# Altium project QUTMS_Shutdownboard_V2_1_Base.PrjPcb (part 1 of 2)
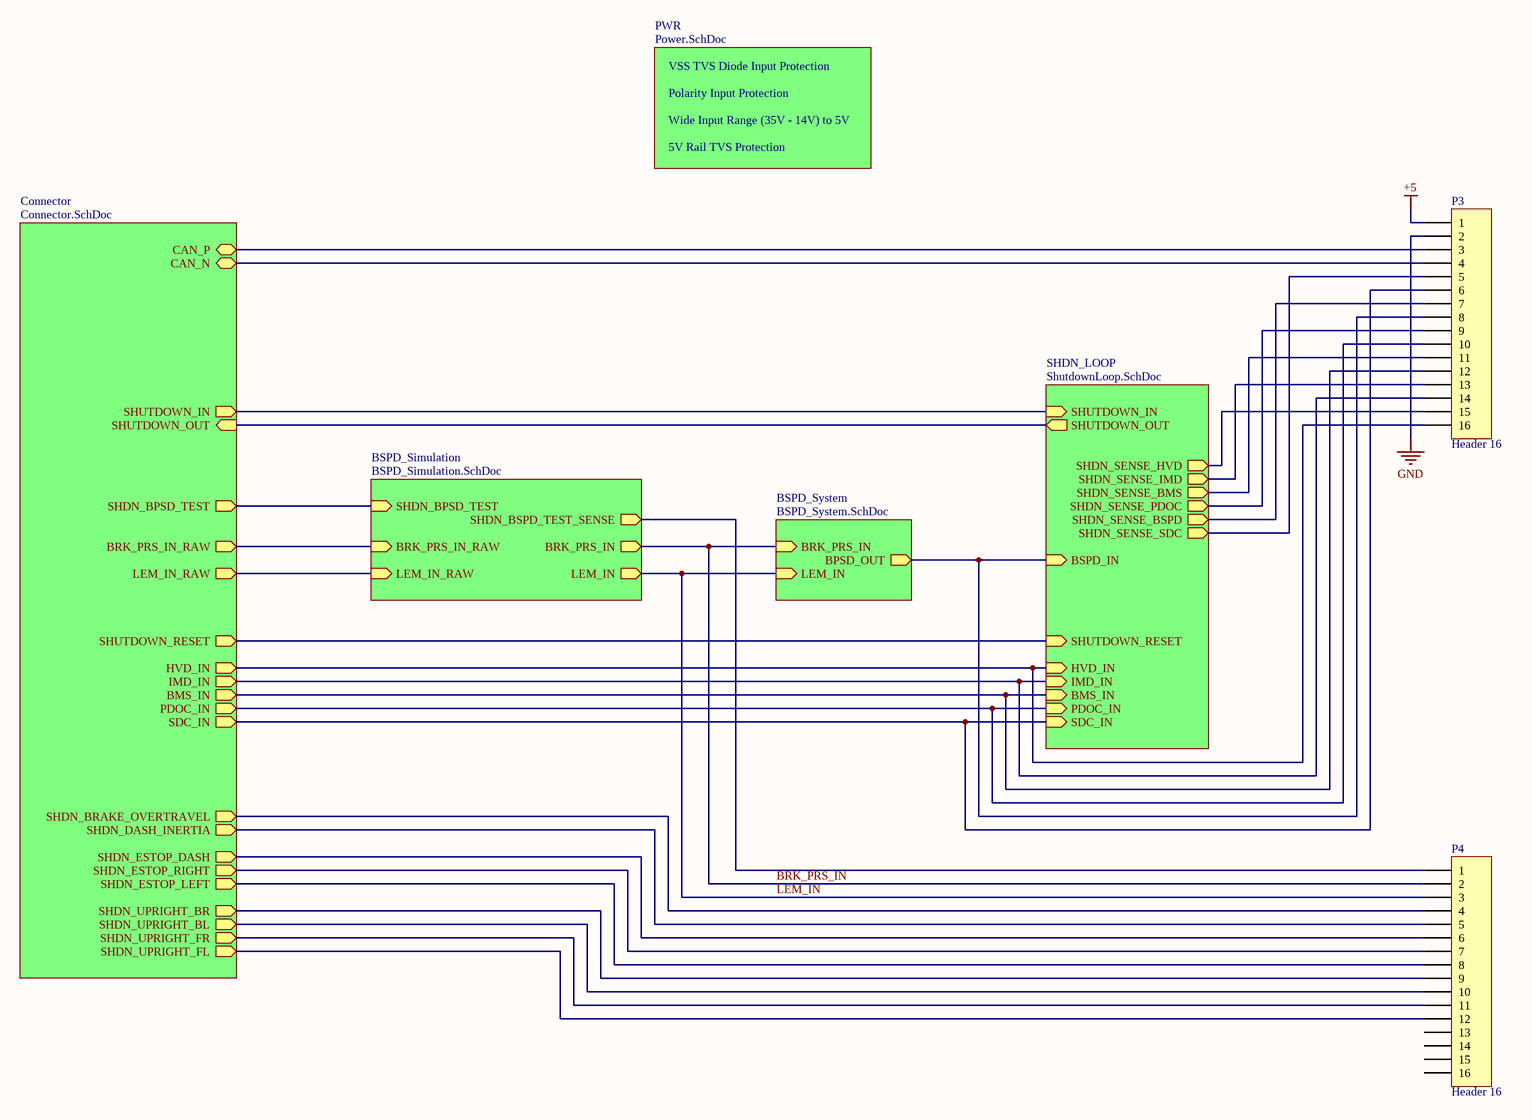
[diagram p0: Master.SchDoc]
7 sheets, 165 parts. Net scope: hierarchical (ports join the sheet entries above them; power ports are global).
Board file: DeutschPCB.PcbDoc
Sheets:
  Master.SchDoc
    Connector = Connector.SchDoc
    SHDN_LOOP = ShutdownLoop.SchDoc
      SHDN_SEG1 = ShutdownSegement.SchDoc
      SHDN_SEG2 = ShutdownSegement.SchDoc
      SHDN_SEG3 = ShutdownSegement.SchDoc
      SHDN_SEG4 = ShutdownSegement.SchDoc
      SHDN_SEG5 = ShutdownSegement.SchDoc
      SHDN_SEG6 = ShutdownSegement.SchDoc
    PWR = Power.SchDoc
    BSPD_System = BSPD_System.SchDoc
    BSPD_Simulation = BSPD_Simulation.SchDoc

## Sheet Master.SchDoc: QUTMS Shutdown Board V2.1 - Master Bottom
size A3; DocumentNumber: 1; Revision: 4; SheetNumber: 1; SheetTotal: 7

### Parts
P3  Header 16  [HDR1X16]
P4  Header 16  [HDR1X16]

### Sub-sheets
BSPD_Simulation = BSPD_Simulation.SchDoc: LEM_IN_RAW (in), SHDN_BSPD_TEST_SENSE (out), BRK_PRS_IN (out), LEM_IN (out), SHDN_BPSD_TEST (in), BRK_PRS_IN_RAW (in)
BSPD_System = BSPD_System.SchDoc: BRK_PRS_IN (in), BPSD_OUT (out), LEM_IN (in)
Connector = Connector.SchDoc: SHDN_BRAKE_OVERTRAVEL (out), SHDN_BPSD_TEST (out), CAN_N (bidir), CAN_P (bidir), SHUTDOWN_IN (out), HVD_IN (out), SHUTDOWN_OUT (in), BRK_PRS_IN_RAW (out), LEM_IN_RAW (out), IMD_IN (out), BMS_IN (out), SHDN_ESTOP_DASH (out), SHDN_DASH_INERTIA (out), PDOC_IN (out), SHUTDOWN_RESET (out), SHDN_ESTOP_RIGHT (out), SHDN_ESTOP_LEFT (out), SHDN_UPRIGHT_BR (out), SHDN_UPRIGHT_BL (out), SHDN_UPRIGHT_FR (out), SHDN_UPRIGHT_FL (out), SDC_IN (out)
PWR = Power.SchDoc: no entries
SHDN_LOOP = ShutdownLoop.SchDoc: SHDN_SENSE_BSPD (out), SHDN_SENSE_PDOC (out), SHDN_SENSE_BMS (out), SHDN_SENSE_IMD (out), HVD_IN (in), SHUTDOWN_RESET (in), IMD_IN (in), BMS_IN (in), PDOC_IN (in), SHUTDOWN_OUT (out), SHUTDOWN_IN (in), BSPD_IN (in), SHDN_SENSE_HVD (out), SDC_IN (in), SHDN_SENSE_SDC (out)

### Nets
+5: P3.1
GND: P3.2
BMS_IN: P3.12 ; sheet Connector/BMS_IN, sheet SHDN_LOOP/BMS_IN
BRK_PRS_IN: P4.2 ; sheet BSPD_System/BRK_PRS_IN, sheet BSPD_Simulation/BRK_PRS_IN
BRK_PRS_IN_RAW: sheet Connector/BRK_PRS_IN_RAW, sheet BSPD_Simulation/BRK_PRS_IN_RAW
CAN_N: P3.4 ; sheet Connector/CAN_N
CAN_P: P3.3 ; sheet Connector/CAN_P
HVD_IN: P3.16 ; sheet Connector/HVD_IN, sheet SHDN_LOOP/HVD_IN
IMD_IN: P3.14 ; sheet Connector/IMD_IN, sheet SHDN_LOOP/IMD_IN
LEM_IN: P4.3 ; sheet BSPD_System/LEM_IN, sheet BSPD_Simulation/LEM_IN
LEM_IN_RAW: sheet Connector/LEM_IN_RAW, sheet BSPD_Simulation/LEM_IN_RAW
PDOC_IN: P3.10 ; sheet Connector/PDOC_IN, sheet SHDN_LOOP/PDOC_IN
SDC_IN: P3.6 ; sheet Connector/SDC_IN, sheet SHDN_LOOP/SDC_IN
SHDN_BPSD_TEST: sheet Connector/SHDN_BPSD_TEST, sheet BSPD_Simulation/SHDN_BPSD_TEST
SHDN_BRAKE_OVERTRAVEL: P4.4 ; sheet Connector/SHDN_BRAKE_OVERTRAVEL
SHDN_BSPD_TEST_COMMAND: P4.1 ; sheet BSPD_Simulation/SHDN_BSPD_TEST_SENSE
SHDN_DASH_INERTIA: P4.5 ; sheet Connector/SHDN_DASH_INERTIA
SHDN_ESTOP_DASH: P4.6 ; sheet Connector/SHDN_ESTOP_DASH
SHDN_ESTOP_LEFT: P4.8 ; sheet Connector/SHDN_ESTOP_LEFT
SHDN_ESTOP_RIGHT: P4.7 ; sheet Connector/SHDN_ESTOP_RIGHT
SHDN_IN1: sheet Connector/SHUTDOWN_IN, sheet SHDN_LOOP/SHUTDOWN_IN
SHDN_OUT6: sheet Connector/SHUTDOWN_OUT, sheet SHDN_LOOP/SHUTDOWN_OUT
SHDN_UPRIGHT_BL: P4.10 ; sheet Connector/SHDN_UPRIGHT_BL
SHDN_UPRIGHT_BR: P4.9 ; sheet Connector/SHDN_UPRIGHT_BR
SHDN_UPRIGHT_FL: P4.12 ; sheet Connector/SHDN_UPRIGHT_FL
SHDN_UPRIGHT_FR: P4.11 ; sheet Connector/SHDN_UPRIGHT_FR
SHUTDOWN_RESET: sheet Connector/SHUTDOWN_RESET, sheet SHDN_LOOP/SHUTDOWN_RESET
STATE_SENSE1: P3.15 ; sheet SHDN_LOOP/SHDN_SENSE_HVD
STATE_SENSE2: P3.13 ; sheet SHDN_LOOP/SHDN_SENSE_IMD
STATE_SENSE3: P3.11 ; sheet SHDN_LOOP/SHDN_SENSE_BMS
STATE_SENSE4: P3.9 ; sheet SHDN_LOOP/SHDN_SENSE_PDOC
STATE_SENSE5: P3.7 ; sheet SHDN_LOOP/SHDN_SENSE_BSPD
STATE_SENSE6: P3.5 ; sheet SHDN_LOOP/SHDN_SENSE_SDC
STATE_TRIGGER5: P3.8 ; sheet SHDN_LOOP/BSPD_IN, sheet BSPD_System/BPSD_OUT

Not connected (* = marked no-connect by the designer): P4 13 14 15 16

### Notes on the sheet
- VSS TVS Diode Input Protection
- Polarity Input Protection
- Wide Input Range (35V - 14V) to 5V
- 5V Rail TVS Protection
- Title
- Size:
- A4
- Number:
- Revision:
- QUT Motorsport, O-120
- O Block, QUT Gardens Point
- Date:
- Time:
- Sheet
- of
- Brisbane, QLD, Australia

### Library data of the parts
P3 P4 = Header 16: Header, 16-Pin; LatestRevisionDate: 17-Jul-2002; LatestRevisionNote: Re-released for DXP Platform.; Publisher: Altium Limited

## Sheet Connector.SchDoc: QUTMS Shutdown V2.1 - Connector
size A4; Organization: QUT Motorsport; Address1: O-120; Address2: O Block; Address3: QUT Gardens Point; Address4: Brisbane, 4000; DocumentNumber: 7; Revision: 3; SheetNumber: 7; SheetTotal: 7
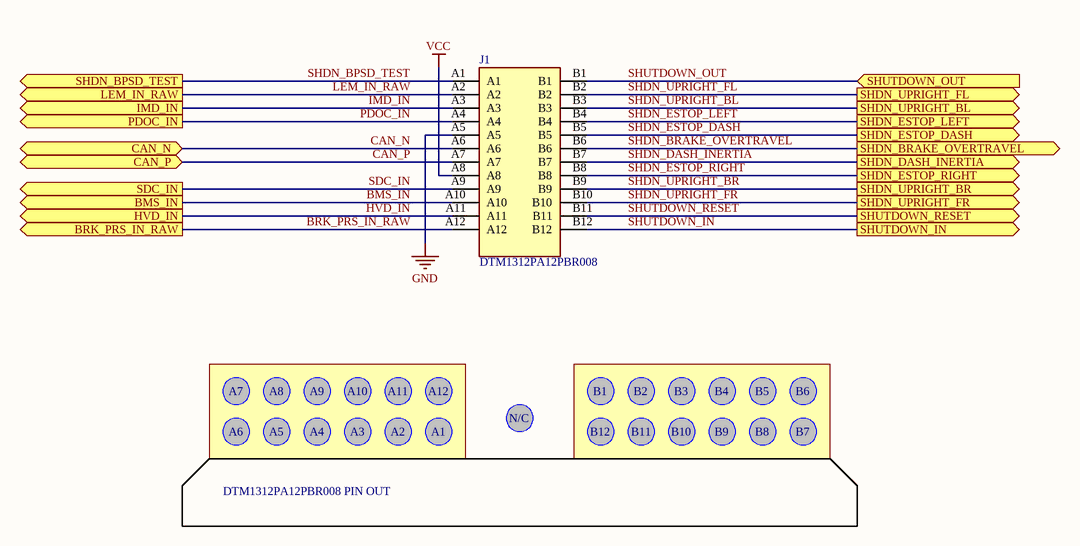
[diagram p1: Connector.SchDoc]

### Parts
J1  DTM1312PA12PBR008  [TE_DTM1312PA12PBR008]

### Ports
BMS_IN (out), BRK_PRS_IN_RAW (out), CAN_N (bidir), CAN_P (bidir), HVD_IN (out), IMD_IN (out), LEM_IN_RAW (out), PDOC_IN (out), SDC_IN (out), SHDN_BPSD_TEST (out), SHDN_BRAKE_OVERTRAVEL (out), SHDN_DASH_INERTIA (out), SHDN_ESTOP_DASH (out), SHDN_ESTOP_LEFT (out), SHDN_ESTOP_RIGHT (out), SHDN_UPRIGHT_BL (out), SHDN_UPRIGHT_BR (out), SHDN_UPRIGHT_FL (out), SHDN_UPRIGHT_FR (out), SHUTDOWN_IN (out), SHUTDOWN_OUT (in), SHUTDOWN_RESET (out)

### Nets
GND: J1.A5
VCC: J1.A8
BMS_IN: J1.A10 ; port BMS_IN
BRK_PRS_IN_RAW: J1.A12 ; port BRK_PRS_IN_RAW
CAN_N: J1.A6 ; port CAN_N
CAN_P: J1.A7 ; port CAN_P
HVD_IN: J1.A11 ; port HVD_IN
IMD_IN: J1.A3 ; port IMD_IN
LEM_IN_RAW: J1.A2 ; port LEM_IN_RAW
PDOC_IN: J1.A4 ; port PDOC_IN
SDC_IN: J1.A9 ; port SDC_IN
SHDN_BPSD_TEST: J1.A1 ; port SHDN_BPSD_TEST
SHDN_BRAKE_OVERTRAVEL: J1.B6 ; port SHDN_BRAKE_OVERTRAVEL
SHDN_DASH_INERTIA: J1.B7 ; port SHDN_DASH_INERTIA
SHDN_ESTOP_DASH: J1.B5 ; port SHDN_ESTOP_DASH
SHDN_ESTOP_LEFT: J1.B4 ; port SHDN_ESTOP_LEFT
SHDN_ESTOP_RIGHT: J1.B8 ; port SHDN_ESTOP_RIGHT
SHDN_UPRIGHT_BL: J1.B3 ; port SHDN_UPRIGHT_BL
SHDN_UPRIGHT_BR: J1.B9 ; port SHDN_UPRIGHT_BR
SHDN_UPRIGHT_FL: J1.B2 ; port SHDN_UPRIGHT_FL
SHDN_UPRIGHT_FR: J1.B10 ; port SHDN_UPRIGHT_FR
SHUTDOWN_IN: J1.B12 ; port SHUTDOWN_IN  [project net SHDN_IN1]
SHUTDOWN_OUT: J1.B1 ; port SHUTDOWN_OUT  [project net SHDN_OUT6]
SHUTDOWN_RESET: J1.B11 ; port SHUTDOWN_RESET

### Notes on the sheet
- A7
- A8
- A9
- A10
- A11
- A12
- N/C
- B1
- B2
- B3
- B4
- B5
- B6
- A6
- A5
- A4
- A3
- A2
- A1
- B12
- B11
- B10
- B9
- B8
- B7
- DTM1312PA12PBR008 PIN OUT
- Title
- Size:
- Number:
- Revision:
- QUT Motorsport, O-120
- O Block, QUT Gardens Point
- Date:
- Time:
- Sheet
- of
- Brisbane, QLD, Australia

### Library data of the parts
J1 = DTM1312PA12PBR008: 24 way sealed A and B key PCB header with .165 inch/4.2 millimeter centerline pitch.; MP: DTM13-12PA-12PB-R008; MF: TE Connectivity; Digi-Key_Part_Number: 1734-1131-ND; Digi-Key_Purchase_URL: https://www.digikey.com/product-detail/en/te-connectivity-deutsch-connectors/DTM13-12PA-12PB-R008/1734-1131-ND/6566695?utm_source=snapeda&utm_medium=aggregator&utm_campaign=symbol; Package: None; Value: *; TE_purchase_URL: https://www.te.com/usa-en/product-DTM1312PA12PBR008.html?te_bu=Cor&te_type=disp&te_campaign=seda_glo_cor-seda-global-disp-prtnr-fy19-seda-model-bom-cta_sma-317_1&elqCampaignId=32493; SnapEDA_Link: https://www.snapeda.com/parts/DTM13-12PA-12PB-R008/TE%20Connectivity%20Deutsch%20Connectors/view-part/490507/?ref=snap

## Sheet ShutdownLoop.SchDoc: QUTMS Shutdown V2.1 - ShutdownLoop
size A4; Organization: QUT Motorsport; Address1: O-120; Address2: O Block; Address3: QUT Gardnes Point; Address4: Brisbane, 4000; DocumentNumber: 2; Revision: 9; SheetNumber: 2; SheetTotal: 7
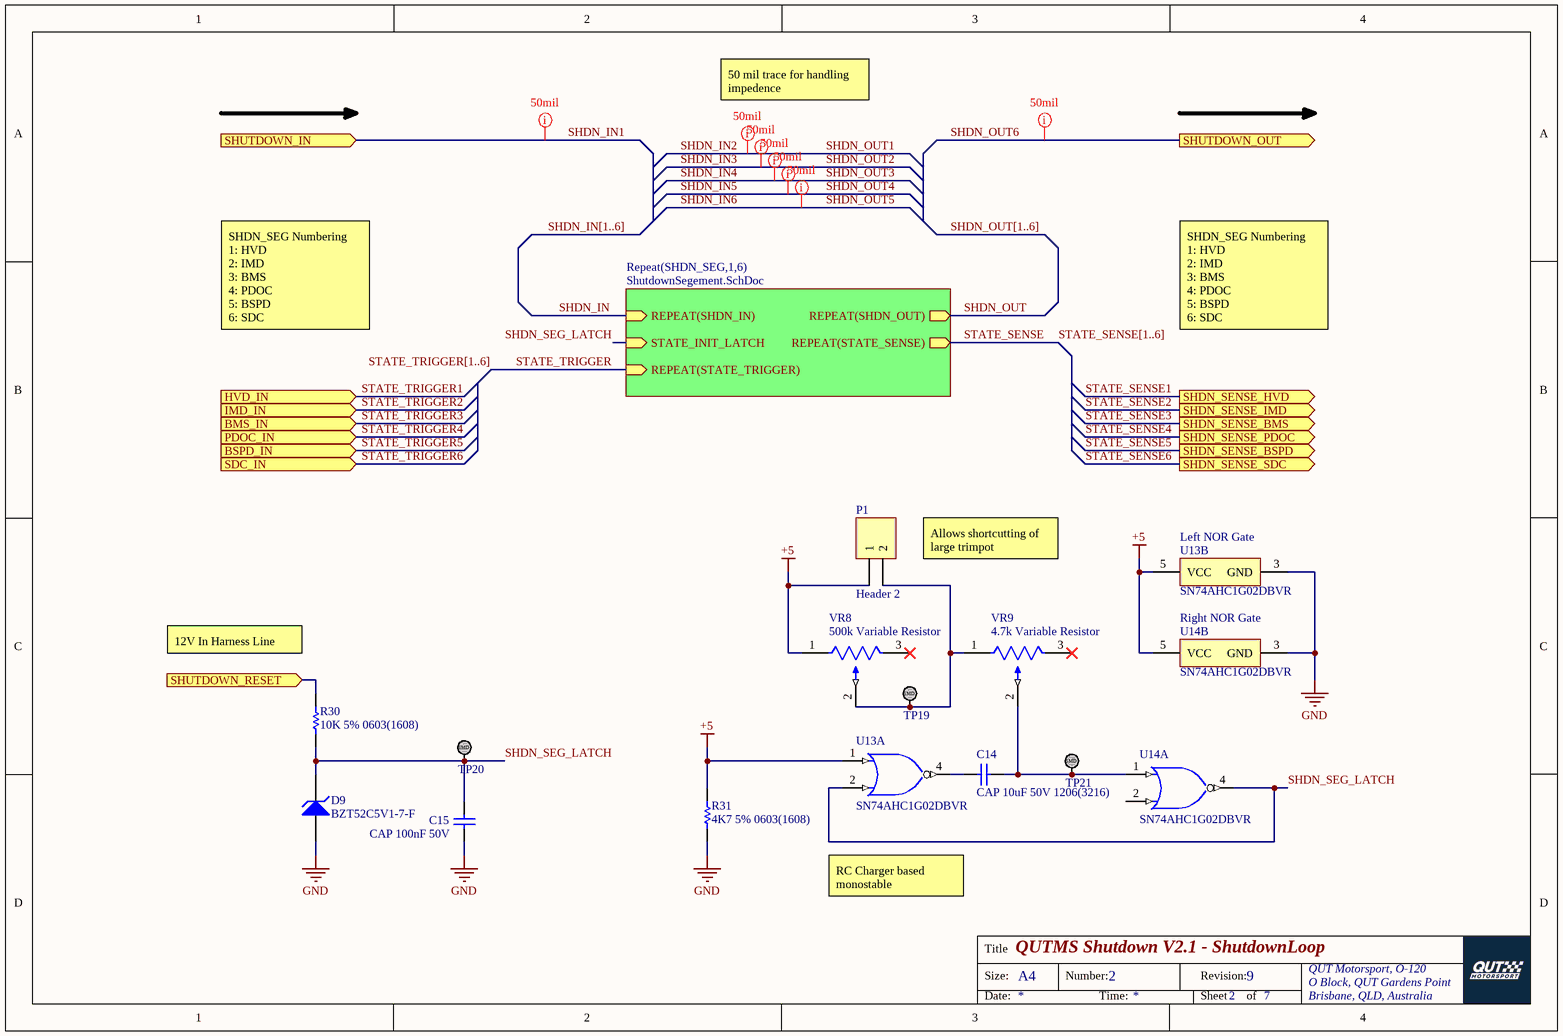
[diagram p2: ShutdownLoop.SchDoc]

### Parts
C14  CAP 10uF 50V 1206(3216)  [CAPC1206(3216)190_M]
C15  CAP 100nF 50V  [CAPC0603(1608)100_L]
D9  BZT52C5V1-7-F  [DIOD-SOD123_V]
P1  Header 2  [HDR1X2]
R30  10K 5% 0603(1608)  [RESC0603(1608)_N]
R31  4K7 5% 0603(1608)  [RESC0603(1608)_N]
TP19  TestPoint_SMD  [TestPointSMD]  (value not drawn)
TP20  TestPoint_SMD  [TestPointSMD]  (value not drawn)
TP21  TestPoint_SMD  [TestPointSMD]  (value not drawn)
U13  SN74AHC1G02DBVR  [DBV0005A_L]  (parts A,B of 2)
U14  SN74AHC1G02DBVR  [DBV0005A_L]  (parts A,B of 2)
VR8  500k Variable Resistor  [VG039NCHXTB472]
VR9  4.7k Variable Resistor  [VG039NCHXTB472]

### Sub-sheets
Repeat(SHDN_SEG,1,6) = ShutdownSegement.SchDoc: REPEAT(SHDN_OUT) (out), REPEAT(SHDN_IN) (in), STATE_INIT_LATCH (in), REPEAT(STATE_TRIGGER) (in), REPEAT(STATE_SENSE) (out)

### Ports
BMS_IN (in), BSPD_IN (in), HVD_IN (in), IMD_IN (in), PDOC_IN (in), SDC_IN (in), SHDN_SENSE_BMS (out), SHDN_SENSE_BSPD (out), SHDN_SENSE_HVD (out), SHDN_SENSE_IMD (out), SHDN_SENSE_PDOC (out), SHDN_SENSE_SDC (out), SHUTDOWN_IN (in), SHUTDOWN_OUT (out), SHUTDOWN_RESET (in)

### Nets
+5: P1.1 R31.2 U13.1(A) U13.5(VCC) U14.5(VCC) VR8.1
GND: C15.2 D9.1(A) R31.1 U13.3(GND) U14.3(GND)
SHDN_IN: sheet Repeat(SHDN_SEG,1,6)/REPEAT(SHDN_IN)
SHDN_OUT: sheet Repeat(SHDN_SEG,1,6)/REPEAT(SHDN_OUT)
SHDN_SEG_LATCH: C15.1 D9.2(K) R30.2 TP20.1 U13.2(B) U14.4(Y) ; sheet Repeat(SHDN_SEG,1,6)/STATE_INIT_LATCH
SHUTDOWN_RESET: R30.1 ; port SHUTDOWN_RESET
STATE_SENSE: sheet Repeat(SHDN_SEG,1,6)/REPEAT(STATE_SENSE)
STATE_TRIGGER: sheet Repeat(SHDN_SEG,1,6)/REPEAT(STATE_TRIGGER)
NetC14_1: C14.1 TP21.1 U14.1(A) VR9.2
NetC14_2: C14.2 U13.4(Y)
NetP1_2: P1.2 TP19.1 VR8.2 VR9.1

Not connected (* = marked no-connect by the designer): U14 2(B); VR8 3(49)*; VR9 3(49)*

### Buses and harness runs
bus SHDN_IN[1..6]
bus SHDN_OUT[1..6]
bus STATE_SENSE[1..6]
bus STATE_TRIGGER[1..6]

### Layout directives
rule Width Constraint [Pref Width = 50mil    Min Width = 50mil    Max Width = 50mil]: SHDN_IN1, SHDN_IN2, SHDN_IN3, SHDN_IN4, SHDN_IN5, SHDN_IN6, SHDN_OUT6

### Notes on the sheet
- 50 mil trace for handling impedence
- SHDN_SEG Numbering
  1: HVD
  2: IMD
  3: BMS
  4: PDOC
  5: BSPD
  6: SDC
- (near P1) Allows shortcutting of large trimpot
- (near U13) Left NOR Gate
- 12V In Harness Line
- Right NOR Gate
- RC Charger based monostable
- Title
- Size:
- A4
- Number:
- Revision:
- QUT Motorsport, O-120
- O Block, QUT Gardens Point
- Date:
- Time:
- Sheet
- of
- Brisbane, QLD, Australia
- (in symbol TestPoint_SMD) SMD

### Library data of the parts
C14 = CMP-1037-04982-1: CAP 10uF 50V ±10% 1206 (3216 Metric) Thickness 1.9mm SMD; Case-EIA: 1206; Tolerance: Â±10%; Case-Metric: 3216; Technology: SMT; Max Thickness: 1.9 mm; Value: 10uF; Rated Voltage: 50 V
C15 = CMP-1035-02591-1: CAP 100nF 50V ±5% 0603 (1608 Metric) Thickness 1mm SMD; Tolerance: Â±5%; Case-Metric: 1608; Case-EIA: 0603; Rated Voltage: 50 V; Max Thickness: 1 mm; Technology: SMT; Value: 100nF
D9 = CMP-2000-05976-1: Surface Mount Zener Diode, 5.1 V, -65 to 150 degC, 2-Pin SMD (SOD-123), RoHS, Tape and Reel; Manufacturer: DiodesIncorporated; Unit Weight: 0.000353oz; Zz - Zener Impedance: 60Ohms; Vz - Zener Voltage: 5.1V; Pd - Power Dissipation: 500mW; Zener Current: 5mA; Ir - Reverse Current: 2uA; Voltage Temperature Coefficient: -0.75mV/C; Configuration: Single; Voltage Tolerance: 6%; Height: 1.35mm; Width: 1.7mm; Minimum Operating Temperature: -65C; Series: BZT52C5; Package Description: 2-Pin Surface Mount Device, Body 2.7 x 1.55 mm; Length: 2.85mm; Mounting Technology: SurfaceMount; Brand: DiodesIncorporated; Factory Pack Quantity: 3000; Product Category: ZenerDiodes; RoHS: True; Manufacturer URL: http://www.diodes.com/; Termination Style: SMD/SMT; Package / Case: SOD-123; Packaging: Reel; Package Reference: SOD123; Datasheet Version: Rev. 37-2, 09/2012; Maximum Operating Temperature: +150C; Datasheet URL: http://www.diodes.com/_files/datasheets/ds18004.pdf; Mounting Style: SMD/SMT
P1 = Header 2: Header, 2-Pin; LatestRevisionDate: 17-Jul-2002; LatestRevisionNote: Re-released for DXP Platform.; Publisher: Altium Limited
R30 = CMP-1012-00098-1: 10K 0.1W 5% 0603 (1608 Metric)  SMD; Case-EIA: 0603; Value: 10000.00 Ohm; Case-Metric: 1608; Technology: SMT; Tolerance: 5 %; Power: 0.1 W
R31 = CMP-1012-00090-1: 4K7 0.1W 5% 0603 (1608 Metric)  SMD; Case-Metric: 1608; Value: 4700.00 Ohm; Case-EIA: 0603; Tolerance: 5 %; Technology: SMT; Power: 0.1 W
U13 U14 = CMP-0859-00024-3: Single 2-Input Positive-NOR Gate, DBV0005A, LARGE T&R; Manufacturer: Texas Instruments; Output Drive (IOL/IOH)(Max)(mA): 50/-50; Sub-Family: NAND Gate; Gate Type: NOR; Output Type: CMOS; 3-State Output: No; Voltage(Nom)(V): 3.3,5; tpd @ Nom Voltage(Max)(ns): 11.4,7.5; Bits(#): 1; VCC(Max)(V): 5.5; ICC @ Nom Voltage(Max)(mA): 0.01; VCC(Min)(V): 2; Technology Family: AHC; Rating: Catalog; Logic: True; F @ Nom Voltage(Max)(Mhz): 75; DatasheetVersion: SCLS342M; Input Type: CMOS; Operating Temperature Range(C): -40 to 125,-40 to 85; Generic Part Number: SN74AHC1G02; PackageReference: DBV0005A; Schmitt Trigger: No
VR8 = 500k Variable Resistor: 500K ±25% ±250 ppm/°C SMD Variable Resistors RoHS | VG039NCHXTB504; ComponentLink1Description: LCSC; ComponentLink1URL: https://lcsc.com/product-detail/Variable-Resistors_HDK-Hokuriku-Elec-Industry-VG039NCHXTB504_C128558.html
VR9 = 4.7k Variable Resistor: 4k7 ±25% ±250 ppm/°C SMD Variable Resistors RoHS | VG039NCHXTB472; ComponentLink1Description: LCSC; ComponentLink1URL: https://lcsc.com/product-detail/Variable-Resistors_HDK-Hokuriku-Elec-Industry-VG039NCHXTB472_C128555.html

## Sheet ShutdownSegement.SchDoc: QUTMS Shutdown V2.1 - Shutdown Segment
size A4; DocumentNumber: 3; Revision: 6; SheetNumber: 3; SheetTotal: 7
Used 6 times, as channels SHDN_LOOP/SHDN_SEG1, SHDN_LOOP/SHDN_SEG2, SHDN_LOOP/SHDN_SEG3, SHDN_LOOP/SHDN_SEG4, SHDN_LOOP/SHDN_SEG5, SHDN_LOOP/SHDN_SEG6. Parts and nets are listed once, with the designators drawn on the sheet.
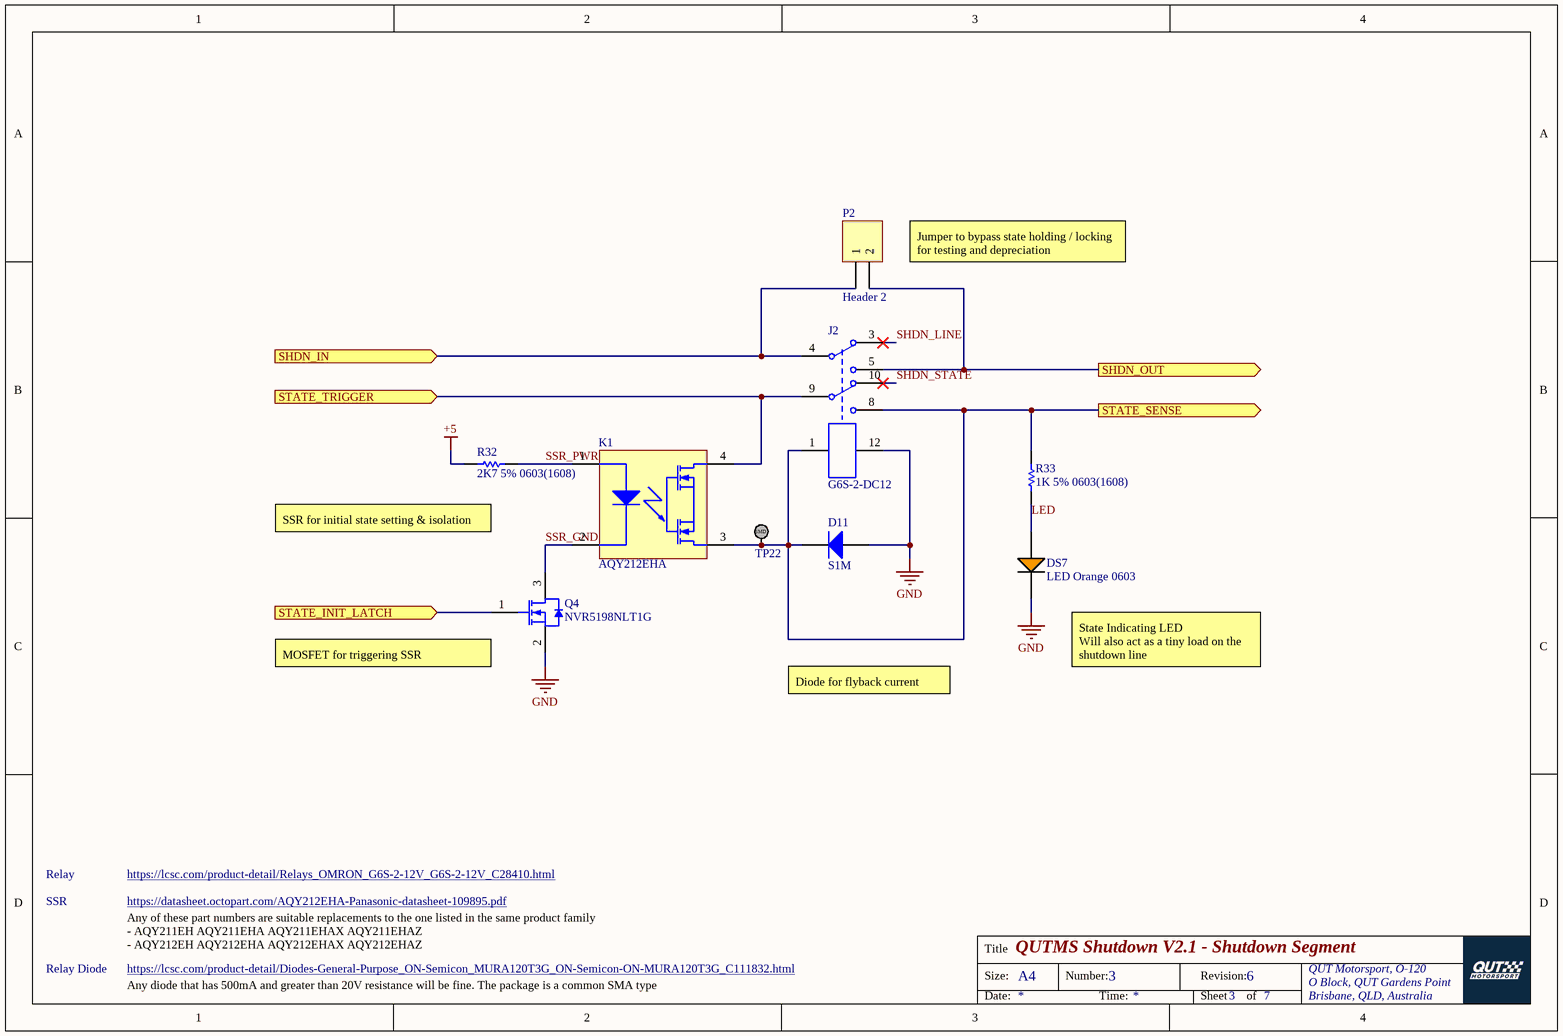
[diagram p3: ShutdownSegement.SchDoc]

### Parts
D11  S1M  [FAIR-DO-214AC-2_V]
DS7  LED Orange 0603  [LED ORANGE 0603]
J2  G6S-2-DC12  [G6S-2]
K1  AQY212EHA  [PNSC-DIP4(SMT)_V]
P2  Header 2  [HDR1X2]
Q4  NVR5198NLT1G  [ONSC-SOT-23-3-318-08_V]
R32  2K7 5% 0603(1608)  [RESC0603(1608)_M]
R33  1K 5% 0603(1608)  [RESC0603(1608)_L]
TP22  TestPoint_SMD  [TestPointSMD]  (value not drawn)

### Ports
SHDN_IN (in), SHDN_OUT (out), STATE_INIT_LATCH (in), STATE_SENSE (out), STATE_TRIGGER (in)

### Nets
+5: R32.1
GND: D11.1(A) DS7.2(C) J2.12 Q4.2(S)
LED: DS7.1(A) R33.1
SHDN_IN: J2.4 P2.1 ; port SHDN_IN
SHDN_LINE: J2.3
SHDN_OUT: J2.5 P2.2 ; port SHDN_OUT
SHDN_STATE: J2.10
SSR_GND: K1.2 Q4.3(D)
SSR_PWR: K1.1 R32.2
STATE_INIT_LATCH: Q4.1(G) ; port STATE_INIT_LATCH
STATE_SENSE: D11.2(K) J2.1 J2.8 K1.3 R33.2 TP22.1 ; port STATE_SENSE
STATE_TRIGGER: J2.9 K1.4 ; port STATE_TRIGGER

### Channels
SHDN_LOOP/SHDN_SEG1: designators end in _SHDN_SEG1; ports SHDN_IN=SHDN_IN1 SHDN_OUT=SHDN_IN2 STATE_INIT_LATCH=SHDN_SEG_LATCH STATE_SENSE=STATE_SENSE1 STATE_TRIGGER=HVD_IN
SHDN_LOOP/SHDN_SEG2: designators end in _SHDN_SEG2; ports SHDN_IN=SHDN_IN2 SHDN_OUT=SHDN_IN3 STATE_INIT_LATCH=SHDN_SEG_LATCH STATE_SENSE=STATE_SENSE2 STATE_TRIGGER=IMD_IN
SHDN_LOOP/SHDN_SEG3: designators end in _SHDN_SEG3; ports SHDN_IN=SHDN_IN3 SHDN_OUT=SHDN_IN4 STATE_INIT_LATCH=SHDN_SEG_LATCH STATE_SENSE=STATE_SENSE3 STATE_TRIGGER=BMS_IN
SHDN_LOOP/SHDN_SEG4: designators end in _SHDN_SEG4; ports SHDN_IN=SHDN_IN4 SHDN_OUT=SHDN_IN5 STATE_INIT_LATCH=SHDN_SEG_LATCH STATE_SENSE=STATE_SENSE4 STATE_TRIGGER=PDOC_IN
SHDN_LOOP/SHDN_SEG5: designators end in _SHDN_SEG5; ports SHDN_IN=SHDN_IN5 SHDN_OUT=SHDN_IN6 STATE_INIT_LATCH=SHDN_SEG_LATCH STATE_SENSE=STATE_SENSE5 STATE_TRIGGER=STATE_TRIGGER5
SHDN_LOOP/SHDN_SEG6: designators end in _SHDN_SEG6; ports SHDN_IN=SHDN_IN6 SHDN_OUT=SHDN_OUT6 STATE_INIT_LATCH=SHDN_SEG_LATCH STATE_SENSE=STATE_SENSE6 STATE_TRIGGER=SDC_IN

### Notes on the sheet
- (near P2) Jumper to bypass state holding / locking for testing and depreciation
- (near R32) SSR for initial state setting & isolation
- (near Q4) MOSFET for triggering SSR
- Diode for flyback current
- State Indicating LED
  Will also act as a tiny load on the shutdown line
- SSR
- Relay
- https://datasheet.octopart.com/AQY212EHA-Panasonic-datasheet-109895.pdf
- https://lcsc.com/product-detail/Relays_OMRON_G6S-2-12V_G6S-2-12V_C28410.html
- Relay Diode
- Any of these part numbers are suitable replacements to the one listed in the same product family
  - AQY211EH AQY211EHA AQY211EHAX AQY211EHAZ
  - AQY212EH AQY212EHA AQY212EHAX AQY212EHAZ
- https://lcsc.com/product-detail/Diodes-General-Purpose_ON-Semicon_MURA120T3G_ON-Semicon-ON-MURA120T3G_C111832.html
- Any diode that has 500mA and greater than 20V resistance will be fine. The package is a common SMA type
- Title
- Size:
- A4
- Number:
- Revision:
- QUT Motorsport, O-120
- O Block, QUT Gardens Point
- Date:
- Time:
- Sheet
- of
- Brisbane, QLD, Australia
- (in symbol TestPoint_SMD) SMD

### Library data of the parts
D11 = CMP-2000-04942-2: General Purpose Rectifier, 1 A, 1000 V, -55 to 150 degC, 2-Pin DO-214AC, RoHS, Tape and Reel; Manufacturer: Fairchild; Repetitive Reverse Voltage Vrrm Max: 1kV; Reel Quantity: 7500; Forward Voltage: 1V; No. of Pins: 2; External Depth: 2.79mm; Current Ifsm: 30A; Diode Configuration: Single; Reverse Recovery Time trr Max: 1.8µs; Diode Type: StandardRecovery; External Width: 5.28mm; SVHC: NoSVHC(19-Dec-2012); External Length / Height: 2.44mm; Diode Polarity: Cathode; Current If @ Vf: 1A; SMD Marking: 1M; Tape Width: 12mm; Datasheet URL: https://datasheet.ciiva.com/4452/s1m-191340-4452980.pdf; Alternate Case Style: DO-214AC; Package Reference: DO-214AC-2; Diode Case Style: DO-214AC; Package / Case: SMA; Junction Temperature Tj Max: 150degC; Operating Temperature Range: -55degCto+150degC; Operating Temperature Min: -55degC; Datasheet Version: Rev. 1.1.2, 10/2013; Manufacturer URL: https://www.fairchildsemi.com/; Termination Type: SMD; Forward Surge Current Ifsm Max: 30A; Operating Temperature Max: 150degC; Package Description: 2-Pin Surface Mount Device, Body 4.375 x 2.725 mm; Package URL: https://www.fairchildsemi.com/package-drawings/DO/DO214AC.pdf; Reverse Recovery Time trr Typ: 1.8µs; Forward Voltage VF Max: 1V; Forward Current If(AV): 1A
J2 = G6S-2-DC12: Telecom Non Latching 12VDC DPDT 2A Through Hole Relays RoHS; ComponentLink1Description: LCSC; ComponentLink1URL: https://lcsc.com/product-detail/Relays_OMRON_G6S-2-12V_G6S-2-12V_C28410.html
K1 = CMP-1346-00006-1: PhotoMOS GE 1 Form A, 60 V Load Voltage, 0.55 A Continuous Load Current, -40 to 85 degC, 4-Pin DIP(SMT), Tube, RoHS; Manufacturer: Panasonic; Continuous Load Current: 0.55 A; Load Voltage: 60 V; On Resistance (Typ): 0.85 Ohm; Pb-Free: True; ComponentLink2Description: Datasheet; PackageVersion: ASCTB67E, 04/2014; DatasheetVersion: 201404-T; Packing: Tube; ComponentLink1URL: http://www3.panasonic.biz/ac/ae/index.jsp; PackageReference: DIP4(SMT); Series: PhotoMOS GE 1 Form A; RoHS: True; ComponentLink1Description: Manufacturer URL; ComponentLink3Description: Package Specification; PartNumber: AQY212EHA; PackageDescription: 4-Pin Surface Mount Terminal Package, Body 4.78 x 6.4 mm, Pitch 2.54mm; ComponentLink2URL: http://www3.panasonic.biz/ac/e_download/control/relay/photomos/catalog/semi_eng_ge1a_aqy21_e.pdf; ComponentLink3URL: http://www3.panasonic.biz/ac/e_download/control/relay/photomos/catalog/semi_eng_dimensions.pdf?f_cd=401560; Mounting Technology: Surface Mount
P2 = Header 2: Header, 2-Pin; LatestRevisionDate: 17-Jul-2002; LatestRevisionNote: Re-released for DXP Platform.; Publisher: Altium Limited
Q4 = CMP-1058-00774-1: Power MOSFET, 60 V, 155 mOhm, Single N-Channel Logic Level, 3-Pin SOT-23, Pb-Free, Tape and Reel; Manufacturer: On Semiconductor; Ciss Typ (pF): 182; Coss Typ (pF): 25; ID Max (A): 2.2; Crss Typ (pF): 16; V(BR)DSS Min (V): 60; Qrr Typ (nC): 6; VGS Max (V): 20; VGS(th) Max (V): 2.5; Channel Polarity: N Channel; Package Type: SOT-23-3; ComponentLink1URL: http://www.onsemi.com/; ComponentLink2Description: Datasheet; ComponentLink1Description: Manufacturer URL; Mounting Technology: Surface Mount; Configuration: Single; Packing: Tape and Reel; RoHS: Pb-Free; ComponentLink3URL: http://www.onsemi.cn/pub_link/Collateral/318-08.PDF; PackageVersion: Rev. AP, 11/2009; PackageReference: SOT-23-3-318-08; DatasheetVersion: Rev. 1; PackageDescription: 3-Pin Small Outline Transistor, Body 2.92 x 1.3 mm, Pitch 0.95 mm; ComponentLink3Description: Package Specification; ComponentLink2URL: http://www.onsemi.com/pub_link/Collateral/NVR5198NL-D.PDF; PartNumber: NVR5198NLT1G
R32 = CMP-1012-00084-1: 2K7 0.1W 5% 0603 (1608 Metric)  SMD; Case-EIA: 0603; Value: 2700.00 Ohm; Case-Metric: 1608; Tolerance: 5 %; Power: 0.1 W; Technology: SMT
R33 = CMP-1012-00074-1: 1K 0.1W 5% 0603 (1608 Metric)  SMD; Case-EIA: 0603; Case-Metric: 1608; Value: 1000.00 Ohm; Technology: SMT; Tolerance: 5 %; Power: 0.1 W

## Sheet Power.SchDoc: QUTMS Shutdown V2.1 - Power Stage
size A4; Author: Jonn Dillon; Organization: QUT Motorsport; Address1: O-120; Address2: O Block; Address3: QUT Gardens Point; Address4: Brisbane, 4000; DocumentNumber: 6; Revision: 2; SheetNumber: 6; SheetTotal: 7
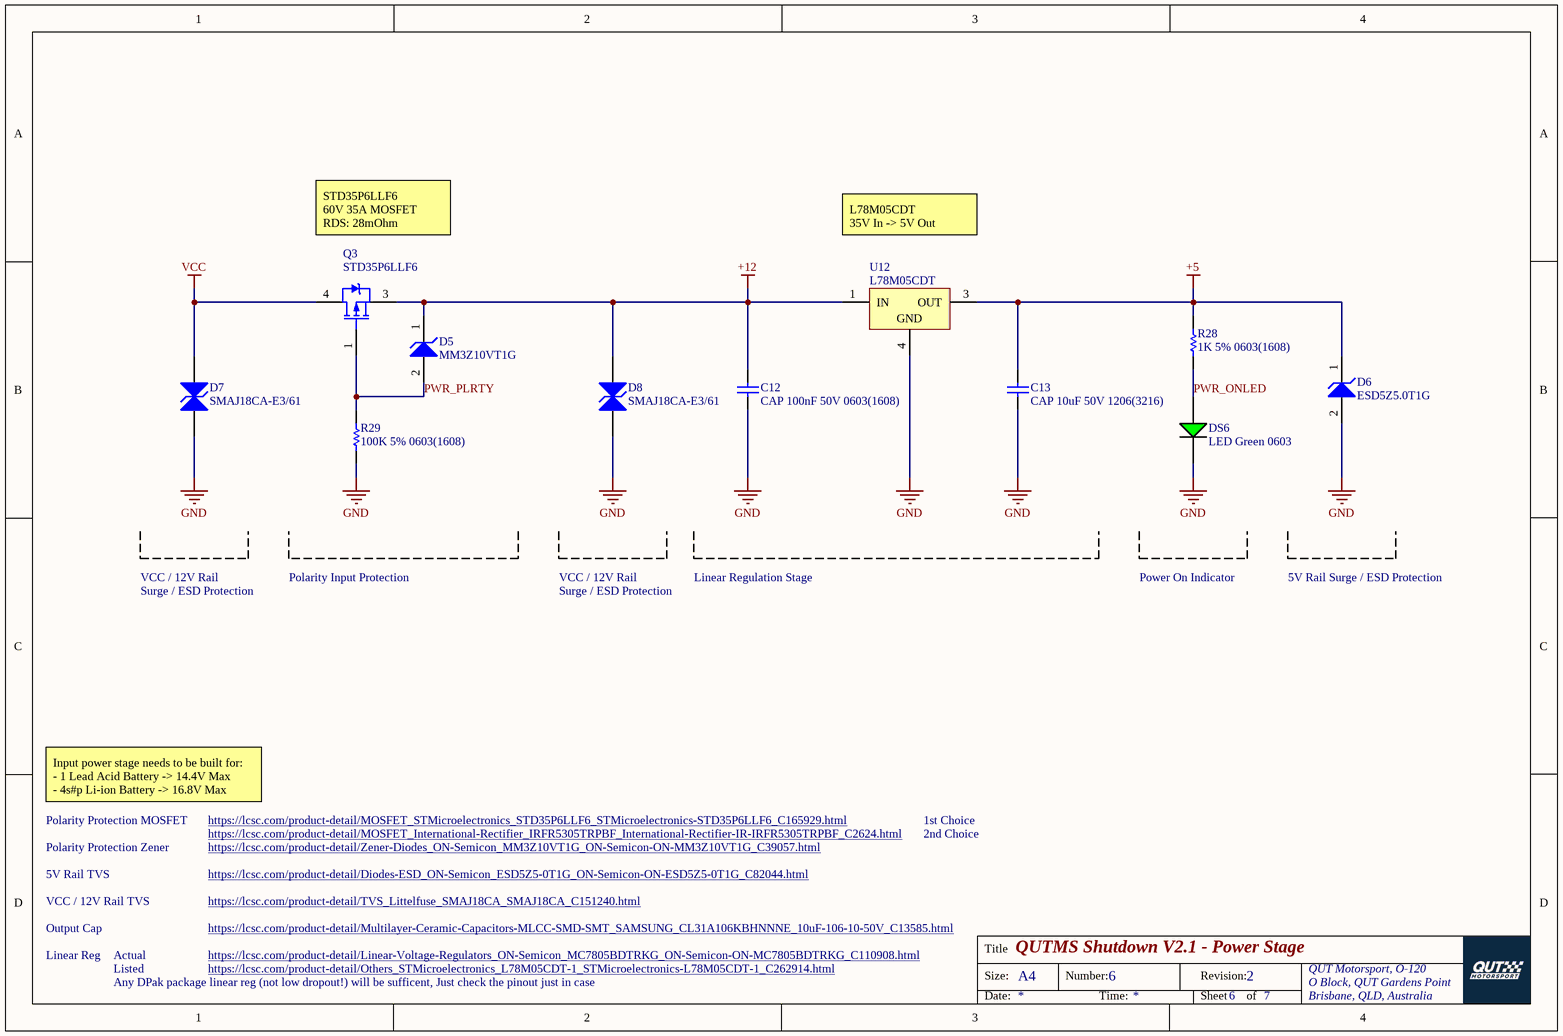
[diagram p4: Power.SchDoc]

### Parts
C12  CAP 100nF 50V 0603(1608)  [CAPC0603(1608)100_N]
C13  CAP 10uF 50V 1206(3216)  [CAPC1206(3216)190_N]
D5  MM3Z10VT1G  [ONSC-SOD-323-2-477-02_V]
D6  ESD5Z5.0T1G  [ONSC-SOD-523-2-502-01_V]
D7  SMAJ18CA-E3/61  [VISH-DO-214AC-2_N]
D8  SMAJ18CA-E3/61  [VISH-DO-214AC-2_N]
DS6  LED Green 0603  [LED GREEN 0603]
Q3  STD35P6LLF6  [ONSC-DPAK-3-369C-01_V]
R28  1K 5% 0603(1608)  [RESC0603(1608)_N]
R29  100K 5% 0603(1608)  [RESC0603(1608)_N]
U12  L78M05CDT  [STM-TO252-3_A_V]

### Nets
+5: C13.2 D6.1(K) R28.2 U12.3(OUT)
+12: C12.2 D5.1(K) D8.2(A2) Q3.3(S) U12.1(IN)
GND: C12.1 C13.1 D6.2(A) D7.1(A1) D8.1(A1) DS6.2(C) R29.1 U12.4(GND)
VCC: D7.2(A2) Q3.4(D)
PWR_ONLED: DS6.1(A) R28.1
PWR_PLRTY: D5.2(A) Q3.1(G) R29.2

### Notes on the sheet
- STD35P6LLF6
  60V 35A MOSFET
  RDS: 28mOhm
- L78M05CDT
  35V In -> 5V Out
- VCC / 12V Rail
- Polarity Input Protection
- Linear Regulation Stage
- Power On Indicator
- 5V Rail Surge / ESD Protection
- Surge / ESD Protection
- Polarity Protection MOSFET
- Polarity Protection Zener
- Input power stage needs to be built for:
  - 1 Lead Acid Battery -> 14.4V Max
  - 4s#p Li-ion Battery -> 16.8V Max
- https://lcsc.com/product-detail/MOSFET_International-Rectifier_IRFR5305TRPBF_International-Rectifier-IR-IRFR5305TRPBF_C2624.html
- https://lcsc.com/product-detail/Zener-Diodes_ON-Semicon_MM3Z10VT1G_ON-Semicon-ON-MM3Z10VT1G_C39057.html
- https://lcsc.com/product-detail/MOSFET_STMicroelectronics_STD35P6LLF6_STMicroelectronics-STD35P6LLF6_C165929.html
- 1st Choice
- 2nd Choice
- 5V Rail TVS
- VCC / 12V Rail TVS
- https://lcsc.com/product-detail/Diodes-ESD_ON-Semicon_ESD5Z5-0T1G_ON-Semicon-ON-ESD5Z5-0T1G_C82044.html
- https://lcsc.com/product-detail/TVS_Littelfuse_SMAJ18CA_SMAJ18CA_C151240.html
- Linear Reg
- Output Cap
- Actual
- Listed
- Any DPak package linear reg (not low dropout!) will be sufficent, Just check the pinout just in case
- https://lcsc.com/product-detail/Multilayer-Ceramic-Capacitors-MLCC-SMD-SMT_SAMSUNG_CL31A106KBHNNNE_10uF-106-10-50V_C13585.html
- https://lcsc.com/product-detail/Linear-Voltage-Regulators_ON-Semicon_MC7805BDTRKG_ON-Semicon-ON-MC7805BDTRKG_C110908.html
- https://lcsc.com/product-detail/Others_STMicroelectronics_L78M05CDT-1_STMicroelectronics-L78M05CDT-1_C262914.html
- Title
- Size:
- A4
- Number:
- Revision:
- QUT Motorsport, O-120
- O Block, QUT Gardens Point
- Date:
- Time:
- Sheet
- of
- Brisbane, QLD, Australia

### Library data of the parts
C12 = CMP-1035-02591-1: as C15 on sheet ShutdownLoop; Rated Voltage: 50 V; Max Thickness: 1 mm; Technology: SMT; Value: 100nF
C13 = CMP-1037-04982-1: as C14 on sheet ShutdownLoop; Technology: SMT; Max Thickness: 1.9 mm; Value: 10uF; Rated Voltage: 50 V
D5 = CMP-1060-00715-1: Zener Voltage Regulator, 300 mW, 2-Pin SOD-323, Pb-Free, Tape and Reel; Manufacturer: On Semiconductor; VZ Typ (V): 10; P Max (W): 0.3; ComponentLink1Description: Manufacturer URL; DatasheetVersion: Rev. 9; PartNumber: MM3Z10VT1G; PackageDescription: 2-Pin SOD, Body 1.7 x 1.25 mm; Packing: Tape and Reel; ComponentLink1URL: http://www.onsemi.com/; PackageReference: SOD-323-2-477-02; PackageVersion: Rev. H, 03/2007; ComponentLink3URL: http://www.onsemi.com/pub_link/Collateral/477-02.PDF.1; Mounting Technology: Surface Mount; RoHS: Pb-Free; ComponentLink2URL: http://www.onsemi.cn/pub_link/Collateral/MM3Z2V4T1-D.PDF; ComponentLink3Description: Package Specification; ComponentLink2Description: Datasheet
D6 = CMP-1063-00102-1: Transient Voltage Suppressor, Micro-Packaged Diode for ESD Protection, 2-Pin SOD-523, Pb-Free, Tape and Reel; Manufacturer: On Semiconductor; V(BR) Min (V): 6.2; VRWM Max (V): 5; Number of Lines: 1; PPK Max (W): 174; IR Max (uA): 0.05; Direction: Unidirectional; PackageVersion: Rev. E, 09/2010; Mounting Technology: Surface Mount; Packing: Tape and Reel; ComponentLink2URL: http://www.onsemi.cn/pub_link/Collateral/ESD5Z2.5T1-D.PDF; ComponentLink2Description: Datasheet; PackageReference: SOD-523-2-502-01; ComponentLink1Description: Manufacturer URL; ComponentLink3URL: http://www.onsemi.com/pub_link/Collateral/502-01.PDF; PackageDescription: 2-Pin SOD, Body 1.2 x 0.8 mm; ComponentLink3Description: Package Specification; ComponentLink1URL: http://www.onsemi.com/; RoHS: Pb-Free; PartNumber: ESD5Z5.0T1G; DatasheetVersion: Rev. 10
D7 D8 = CMP-0548-00180-2: Transient Voltage Suppressor, 6.40 to 231 V, 18 V Stand-off Voltage, Bi-Directional, -55 to 155 degC, 2-pin DO-214AC, Pb-Free, Tape and Reel; Manufacturer: Vishay Semiconductor; VWM (V): 18; IFSM: 40 A; VBR Bi-Directional (V): 6.4 to 231; ID (uA): 2; PPPM (W): 400, 300; PackageDescription: 2-Pin DO-214AC (SMA), Body 4.245 x 2.665 mm; ComponentLink1Description: Manufacturer URL; RoHS: TRUE; ComponentLink3Description: Package Specification; ComponentLink3URL: http://www.vishay.com/docs/88390/smaj50a.pdf; Mounting Technology: Surface Mount; DatasheetVersion: 12/8/2013; ComponentLink1URL: http://www.vishay.com/; ComponentLink2URL: http://www.vishay.com/docs/88390/smaj50a.pdf; PackageReference: DO-214AC-2; ComponentLink2Description: Datasheet; PartNumber: SMAJ18CA-E3/61; Packing: Tape and Reel; Operating Junction and Storage Temperature Range: -55 to 150 degC
Q3 = CMP-1058-00390-1: Power MOSFET, -60 V, -12 A, P-Channel, 3-Pin DPAK, Pb-Free, Tape and Reel; Manufacturer: On Semiconductor; PartNumber: NTD2955T4G; V(BR)DSS Min (V): 60; Qrr Typ (nC): 100; Coss Typ (pF): 150; Crss Typ (pF): 50; PD Max (W): 55; ID Max (A): 12; Channel Polarity: P Channel; Configuration: Single; VGS Max (V): 20; VGS(th) Max (V): 4; Ciss Typ (pF): 500; ComponentLink1URL: http://www.onsemi.com/; DatasheetVersion: Rev. 13; Packing: Tape and Reel; PackageVersion: Rev. E, 02/2014; Mounting Technology: Surface Mount; ComponentLink3Description: Package Specification; Package Type: DPAK-3, IPAK-4; ComponentLink3URL: http://www.onsemi.cn/pub_link/Collateral/369C.PDF; RoHS: Pb-Free; ComponentLink2URL: http://www.onsemi.cn/pub_link/Collateral/NTD2955-D.PDF; ComponentLink2Description: Datasheet; PackageReference: DPAK-3-369C-01; PackageDescription: 3-Pin Flange Mount, Body 6.54 x 6.095 mm, Pitch 2.29 mm; ComponentLink1Description: Manufacturer URL
R28 = CMP-1012-00074-1: as R33 on sheet ShutdownSegement; Technology: SMT; Tolerance: 5 %; Power: 0.1 W
R29 = CMP-1012-00122-1: 100K 0.1W 5% 0603 (1608 Metric)  SMD; Case-EIA: 0603; Value: 100000.00 Ohm; Case-Metric: 1608; Tolerance: 5 %; Power: 0.1 W; Technology: SMT
U12 = CMP-2000-06530-1: Precision Regulator, 0.5 A, 5 V Output, 0 to 150 degC, 3-Pin DPAK (TO252), RoHS, Tube; Manufacturer: STMicroelectronics; No. of Pins: 3Pins; SVHC: NoSVHC(17-Dec-2015); Input Voltage Max: 35V; Linear Regulator Case Style: TO-252; Output Voltage Nom.: 5V; Output Current: 500mA; Input Voltage Min: 10V; Manufacturer URL: http://www.st.com/; Operating Temperature Min: 0°C; Package Description: 3-Pin Transistor Outline, Body 6.5 x 6.1 mm, Pitch 2.28 mm; Package Reference: TO252; Datasheet Version: Rev. 20, 06/2014; Packaging: Each; Mounting Technology: SurfaceMount; Operating Temperature Max: 150°C; Datasheet URL: http://www.st.com/content/ccc/resource/technical/document/datasheet/d7/5f/dc/5c/d5/b6/48/7c/CD00000447.pdf/files/CD00000447.pdf/jcr:content/translations/en.CD00000447.pdf

## Sheet BSPD_System.SchDoc: QUTMS Shutdown V2.1 - BSPD System
size A3; Author: Jonn Dillon; Organization: QUT Motorsport; Address1: O-120; Address2: O Block; Address3: QUT Gardens Point; Address4: Brisbane, 4000; DocumentNumber: 4; Revision: 9; SheetNumber: 4; SheetTotal: 7
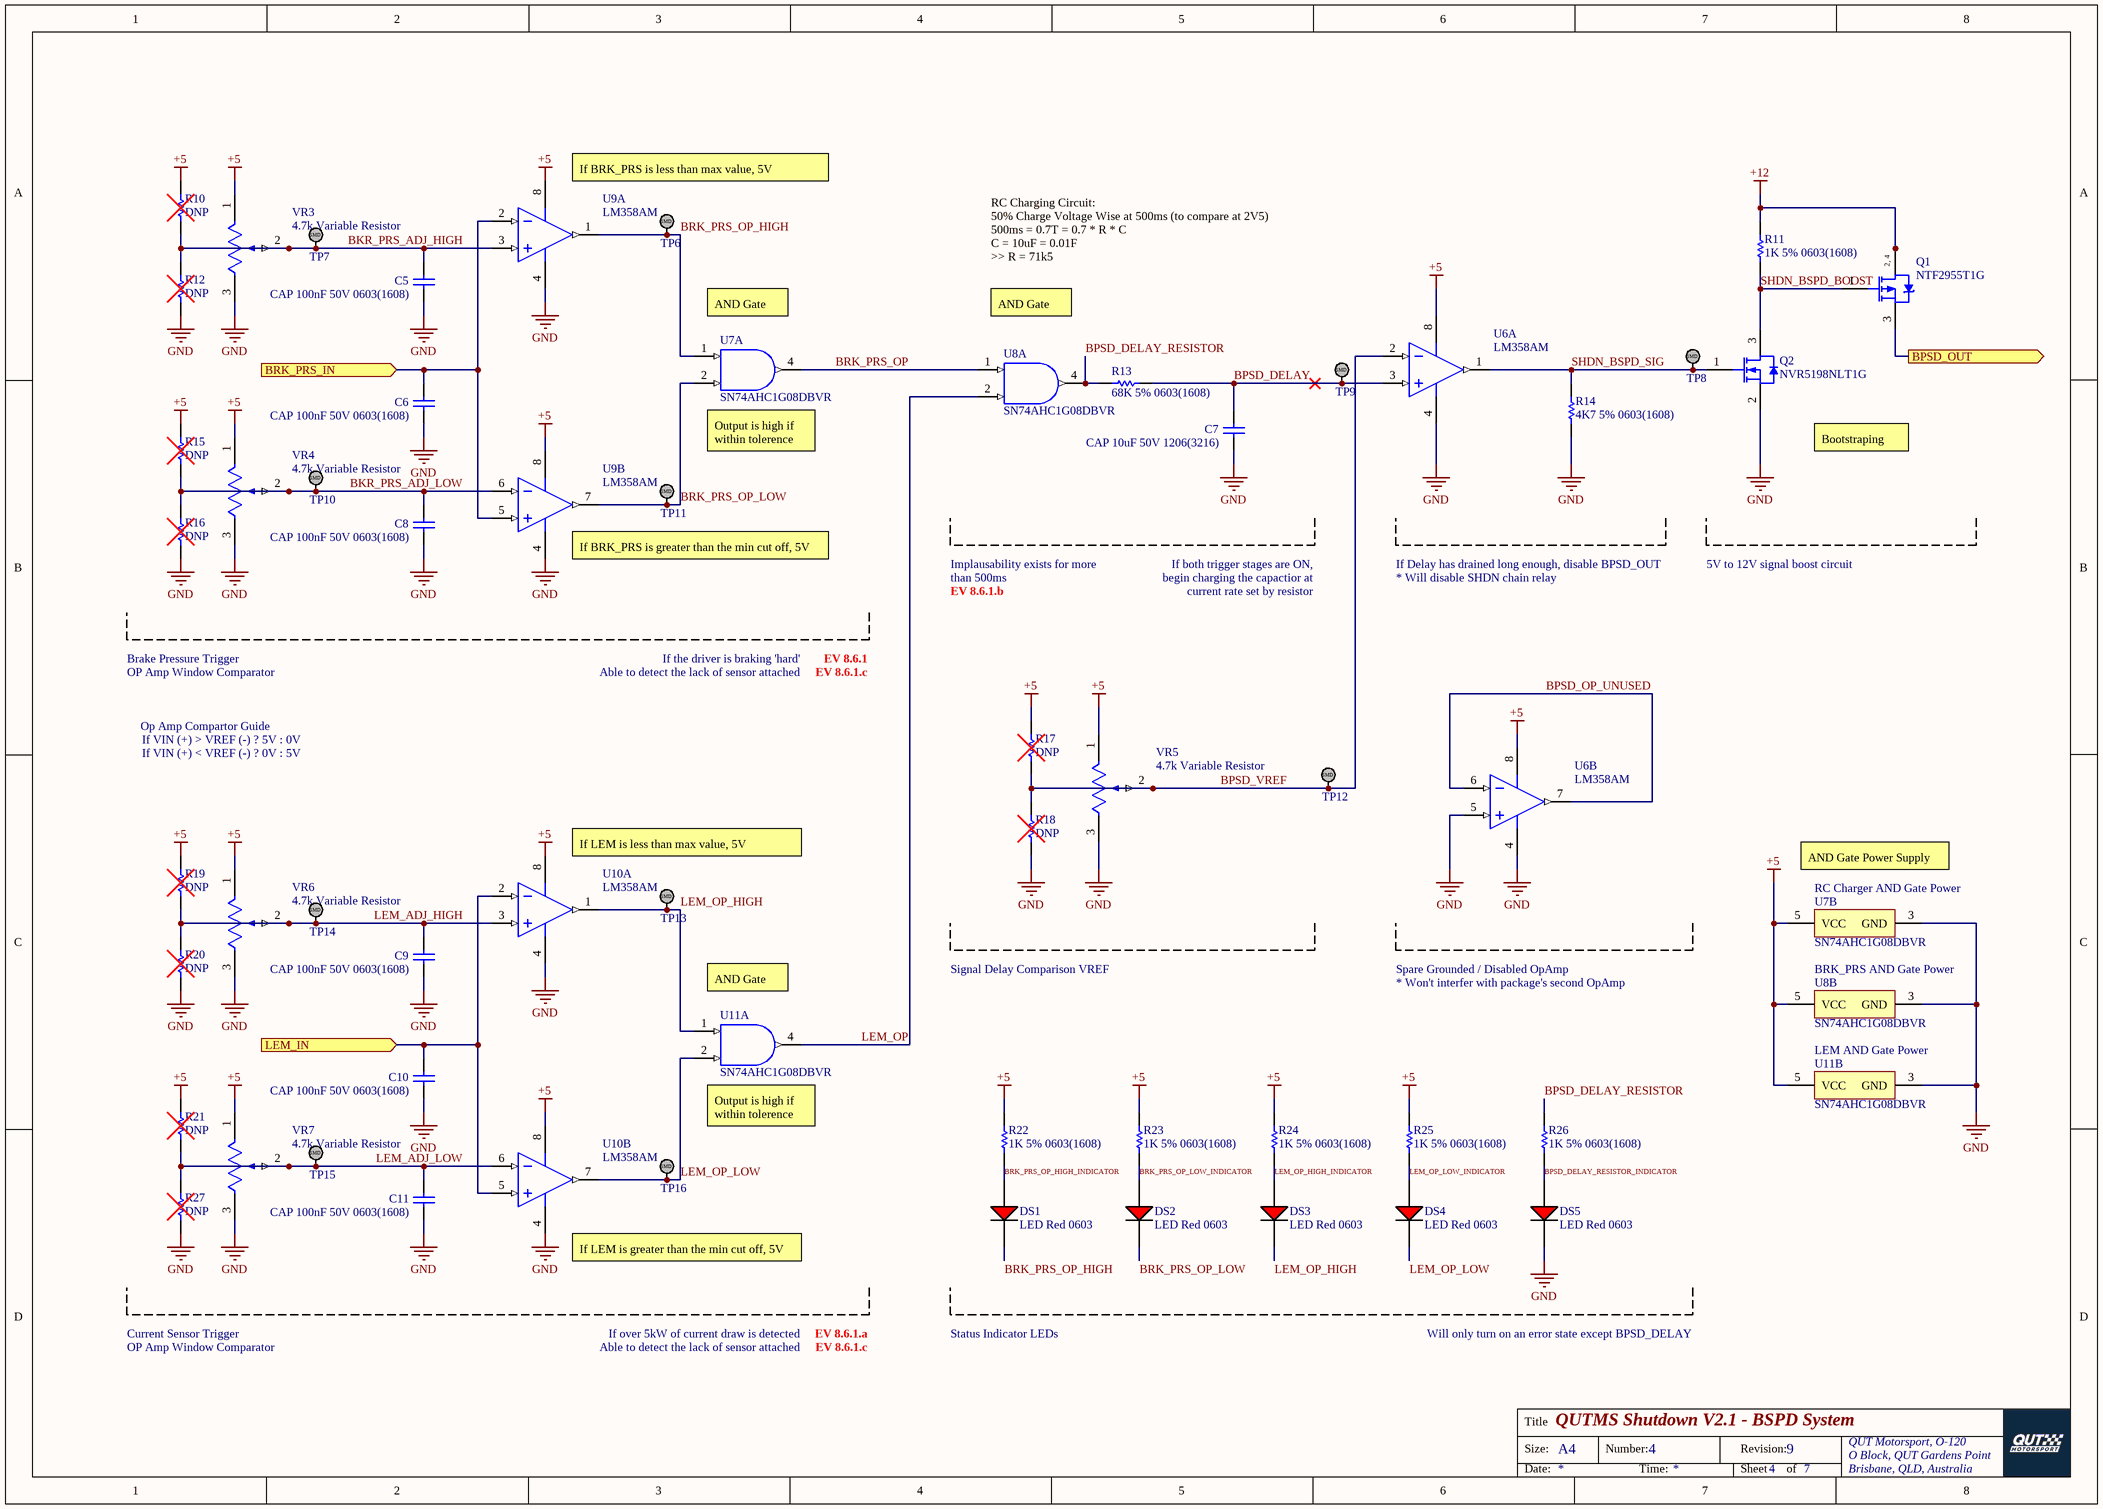
[diagram p5: BSPD_System.SchDoc]

### Parts
C5  CAP 100nF 50V 0603(1608)  [CAPC0603(1608)100_N]
C6  CAP 100nF 50V 0603(1608)  [CAPC0603(1608)100_N]
C7  CAP 10uF 50V 1206(3216)  [CAPC1206(3216)190_N]
C8  CAP 100nF 50V 0603(1608)  [CAPC0603(1608)100_N]
C9  CAP 100nF 50V 0603(1608)  [CAPC0603(1608)100_N]
C10  CAP 100nF 50V 0603(1608)  [CAPC0603(1608)100_N]
C11  CAP 100nF 50V 0603(1608)  [CAPC0603(1608)100_N]
DS1  LED Red 0603  [LED RED 0603]
DS2  LED Red 0603  [LED RED 0603]
DS3  LED Red 0603  [LED RED 0603]
DS4  LED Red 0603  [LED RED 0603]
DS5  LED Red 0603  [LED RED 0603]
Q1  NTF2955T1G  [ONSC-SOT-223-4-318E-04_V]
Q2  NVR5198NLT1G  [ONSC-SOT-23-3-318-08_V]
R10  DNP  [RESC0603(1608)_L]
R11  1K 5% 0603(1608)  [RESC0603(1608)_L]
R12  DNP  [RESC0603(1608)_L]
R13  68K 5% 0603(1608)  [RESC0603(1608)_N]
R14  4K7 5% 0603(1608)  [RESC0603(1608)_N]
R15  DNP  [RESC0603(1608)_L]
R16  DNP  [RESC0603(1608)_L]
R17  DNP  [RESC0603(1608)_L]
R18  DNP  [RESC0603(1608)_L]
R19  DNP  [RESC0603(1608)_L]
R20  DNP  [RESC0603(1608)_L]
R21  DNP  [RESC0603(1608)_L]
R22  1K 5% 0603(1608)  [RESC0603(1608)_L]
R23  1K 5% 0603(1608)  [RESC0603(1608)_L]
R24  1K 5% 0603(1608)  [RESC0603(1608)_L]
R25  1K 5% 0603(1608)  [RESC0603(1608)_L]
R26  1K 5% 0603(1608)  [RESC0603(1608)_L]
R27  DNP  [RESC0603(1608)_L]
TP6  TestPoint_SMD  [TestPointSMD]  (value not drawn)
TP7  TestPoint_SMD  [TestPointSMD]  (value not drawn)
TP8  TestPoint_SMD  [TestPointSMD]  (value not drawn)
TP9  TestPoint_SMD  [TestPointSMD]  (value not drawn)
TP10  TestPoint_SMD  [TestPointSMD]  (value not drawn)
TP11  TestPoint_SMD  [TestPointSMD]  (value not drawn)
TP12  TestPoint_SMD  [TestPointSMD]  (value not drawn)
TP13  TestPoint_SMD  [TestPointSMD]  (value not drawn)
TP14  TestPoint_SMD  [TestPointSMD]  (value not drawn)
TP15  TestPoint_SMD  [TestPointSMD]  (value not drawn)
TP16  TestPoint_SMD  [TestPointSMD]  (value not drawn)
U6  LM358AM  [D0008A_N]  (parts A,B of 2)
U7  SN74AHC1G08DBVR  [DBV0005A_N]  (parts A,B of 2)
U8  SN74AHC1G08DBVR  [DBV0005A_N]  (parts A,B of 2)
U9  LM358AM  [D0008A_N]  (parts A,B of 2)
U10  LM358AM  [D0008A_N]  (parts A,B of 2)
U11  SN74AHC1G08DBVR  [DBV0005A_N]  (parts A,B of 2)
VR3  4.7k Variable Resistor  [VG039NCHXTB472]
VR4  4.7k Variable Resistor  [VG039NCHXTB472]
VR5  4.7k Variable Resistor  [VG039NCHXTB472]
VR6  4.7k Variable Resistor  [VG039NCHXTB472]
VR7  4.7k Variable Resistor  [VG039NCHXTB472]

### Ports
BPSD_OUT (out), BRK_PRS_IN (in), LEM_IN (in)

### Nets
+5: R10.2 R15.2 R17.2 R19.2 R21.2 R22.2 R23.2 R24.2 R25.2 U6.8(V+) U7.5(VCC) U8.5(VCC) U9.8(V+) U10.8(V+) U11.5(VCC) VR3.1 VR4.1 VR5.1 VR6.1 VR7.1
+12: Q1.2(D) Q1.4(D) R11.2
GND: C5.2 C6.2 C7.1 C8.2 C9.2 C10.2 C11.2 DS5.2(C) Q2.2(S) R12.1 R14.1 R16.1 R18.1 R20.1 R27.1 U6.4(GND) U6.5(INB+) U7.3(GND) U8.3(GND) U9.4(GND) U10.4(GND) U11.3(GND) VR3.3 VR4.3 VR5.3 VR6.3 VR7.3
BKR_PRS_ADJ_HIGH: C5.1 R10.1 R12.2 TP7.1 U9.3(INA+) VR3.2
BKR_PRS_ADJ_LOW: C8.1 R15.1 R16.2 TP10.1 U9.6(INB-) VR4.2
BPSD_DELAY: C7.2 R13.2 TP9.1 U6.3(INA+)
BPSD_DELAY_RESISTOR: R13.1 R26.2 U8.4(Y)
BPSD_DELAY_RESISTOR_INDICATOR: DS5.1(A) R26.1
BPSD_OP_UNUSED: U6.6(INB-) U6.7(OUTB)
BPSD_VREF: R17.1 R18.2 TP12.1 U6.2(INA-) VR5.2
BRK_PRS_IN: C6.1 U9.2(INA-) U9.5(INB+) ; port BRK_PRS_IN
BRK_PRS_OP: U7.4(Y) U8.1(A)
BRK_PRS_OP_HIGH: DS1.2(C) TP6.1 U7.1(A) U9.1(OUTA)
BRK_PRS_OP_HIGH_INDICATOR: DS1.1(A) R22.1
BRK_PRS_OP_LOW: DS2.2(C) TP11.1 U7.2(B) U9.7(OUTB)
BRK_PRS_OP_LOW_INDICATOR: DS2.1(A) R23.1
LEM_ADJ_HIGH: C9.1 R19.1 R20.2 TP14.1 U10.3(INA+) VR6.2
LEM_ADJ_LOW: C11.1 R21.1 R27.2 TP15.1 U10.6(INB-) VR7.2
LEM_IN: C10.1 U10.2(INA-) U10.5(INB+) ; port LEM_IN
LEM_OP: U8.2(B) U11.4(Y)
LEM_OP_HIGH: DS3.2(C) TP13.1 U10.1(OUTA) U11.1(A)
LEM_OP_HIGH_INDICATOR: DS3.1(A) R24.1
LEM_OP_LOW: DS4.2(C) TP16.1 U10.7(OUTB) U11.2(B)
LEM_OP_LOW_INDICATOR: DS4.1(A) R25.1
SHDN_BSPD_BOOST: Q1.1(G) Q2.3(D) R11.1
SHDN_BSPD_SIG: Q2.1(G) R14.2 TP8.1 U6.1(OUTA)
STATE_TRIGGER5: Q1.3(S) ; port BPSD_OUT

### Notes on the sheet
- (near U9) If BRK_PRS is less than max value, 5V
- (near U7) AND Gate
- RC Charging Circuit:
  50% Charge Voltage Wise at 500ms (to compare at 2V5)
  500ms = 0.7T = 0.7 * R * C
  C = 10uF = 0.01F
  >> R = 71k5
- AND Gate
- (near U7) Output is high if within tolerence
- Bootstraping
- (near U9) If BRK_PRS is greater than the min cut off, 5V
- Implausability exists for more
- than 500ms
- begin charging the capactior at
- If both trigger stages are ON,
- If Delay has drained long enough, disable BPSD_OUT
- * Will disable SHDN chain relay
- 5V to 12V signal boost circuit
- EV 8.6.1.b
- current rate set by resistor
- Brake Pressure Trigger
- OP Amp Window Comparator
- If the driver is braking 'hard'
- Able to detect the lack of sensor attached
- EV 8.6.1
- EV 8.6.1.c
- Op Amp Compartor Guide
- If VIN (+) > VREF (-) ? 5V : 0V
- If VIN (+) < VREF (-) ? 0V : 5V
- (near U10) If LEM is less than max value, 5V
- AND Gate Power Supply
- (near U7) RC Charger AND Gate Power
- (near U11) AND Gate
- Signal Delay Comparison VREF
- Spare Grounded / Disabled OpAmp
- * Won't interfer with package's second OpAmp
- BRK_PRS AND Gate Power
- LEM AND Gate Power
- (near U11) Output is high if within tolerence
- (near U10) If LEM is greater than the min cut off, 5V
- Current Sensor Trigger
- If over 5kW of current draw is detected
- EV 8.6.1.a
- Status Indicator LEDs
- Will only turn on an error state except BPSD_DELAY
- Title
- Size:
- A4
- Number:
- Revision:
- QUT Motorsport, O-120
- O Block, QUT Gardens Point
- Date:
- Time:
- Sheet
- of
- Brisbane, QLD, Australia
- (in symbol CMP-1058-00728-1) 2, 4
- (in symbol TestPoint_SMD) SMD

### Library data of the parts
C5 C6 C8-C11 = CMP-1035-02591-1: as C15 on sheet ShutdownLoop; Rated Voltage: 50 V; Max Thickness: 1 mm; Technology: SMT; Value: 100nF
C7 = CMP-1037-04982-1: as C14 on sheet ShutdownLoop; Technology: SMT; Max Thickness: 1.9 mm; Value: 10uF; Rated Voltage: 50 V
Q1 = CMP-1058-00728-1: Power MOSFET, -60 V, -2.6 A, Single P-Channel, 4-Pin SOT-223, Pb-Free, Tape and Reel; Manufacturer: On Semiconductor; Ciss Typ (pF): 492; Coss Typ (pF): 165; VGS(th) Max (V): 4; VGS Max (V): 20; ID Max (A): 2.6; Crss Typ (pF): 50; Channel Polarity: P Channel; V(BR)DSS Min (V): 60; Qrr Typ (nC): 0.139; Mounting Technology: Surface Mount; RoHS: Pb-Free; ComponentLink3URL: http://www.onsemi.com/pub_link/Collateral/318E-04.PDF; Packing: Tape and Reel; ComponentLink1URL: http://www.onsemi.com/; PackageReference: SOT-223-4-318E-04; Configuration: Single; PartNumber: NTF2955T1G; ComponentLink3Description: Package Specification; DatasheetVersion: Rev. 6; ComponentLink2Description: Datasheet; ComponentLink2URL: http://www.onsemi.com/pub_link/Collateral/NTF2955-D.PDF; PackageDescription: 4-Pin Small Outline Transistor, Body 6.5 x 3.5 mm, Pitch 2.3 mm; Package Type: SOT-223-4 / TO-261-4; ComponentLink1Description: Manufacturer URL; PackageVersion: Rev. N, 08/2009
Q2 = CMP-1058-00774-1: as Q4 on sheet ShutdownSegement; Package Type: SOT-23-3; ComponentLink1URL: http://www.onsemi.com/; ComponentLink2Description: Datasheet; ComponentLink1Description: Manufacturer URL; Mounting Technology: Surface Mount; Configuration: Single; Packing: Tape and Reel; RoHS: Pb-Free; ComponentLink3URL: http://www.onsemi.cn/pub_link/Collateral/318-08.PDF; PackageVersion: Rev. AP, 11/2009; PackageReference: SOT-23-3-318-08; DatasheetVersion: Rev. 1; PackageDescription: 3-Pin Small Outline Transistor, Body 2.92 x 1.3 mm, Pitch 0.95 mm; ComponentLink3Description: Package Specification; ComponentLink2URL: http://www.onsemi.com/pub_link/Collateral/NVR5198NL-D.PDF; PartNumber: NVR5198NLT1G
R10 R12 R15-R21 R27 = CMP-1591-00001-1: 0603 (1608 Metric) Chip Resistor; Case-Metric: 1608; Case-EIA: 0603; PackageReference: RESC0603(1608)
R11 R22-R26 = CMP-1012-00074-1: as R33 on sheet ShutdownSegement; Technology: SMT; Tolerance: 5 %; Power: 0.1 W
R13 = CMP-1012-00118-1: 68K 0.1W 5% 0603 (1608 Metric)  SMD; Case-Metric: 1608; Case-EIA: 0603; Value: 68000.00 Ohm; Tolerance: 5 %; Power: 0.1 W; Technology: SMT
R14 = CMP-1012-00090-1: as R31 on sheet ShutdownLoop; Tolerance: 5 %; Technology: SMT; Power: 0.1 W
U6 U9 U10 = CMP-0055-00796-3: Low Power Dual Operational Amplifier, 8-pin Narrow SOIC; Manufacturer: Texas Instruments; CompType: Amplifiers; PackageTopMarking: NSZXTT*LM*358AM; PowerWise: N; Code_JEDEC: MS-012-AA; RoHS: N; PinCount: 8; Package Reference: D0008A; ComponentLink1Description: Datasheet URL; ComponentLink1URL: http://www.ti.com/general/docs/lit/getliterature.tsp?genericPartNumber=LM358-N&fileType=pdf; Code_IPC: SOIC127P600-8; PackageDescription: SOIC Narrow, 4.9 x 3.9 x 1.45mm, 8 Lead, 1.27mm Pitch
U7 U8 U11 = CMP-0859-00043-3: Single 2-Input Positive-AND Gate, DBV0005A, LARGE T&R; Manufacturer: Texas Instruments; Logic: True; Schmitt Trigger: No; Bits(#): 1; Voltage(Nom)(V): 3.3,5; F @ Nom Voltage(Max)(Mhz): 75; Output Type: CMOS; ICC @ Nom Voltage(Max)(mA): 0.01; Output Drive (IOL/IOH)(Max)(mA): 50/-50; VCC(Max)(V): 5.5; Technology Family: AHC; Gate Type: AND; Rating: Catalog; VCC(Min)(V): 2; tpd @ Nom Voltage(Max)(ns): 12.3,7.9; Generic Part Number: SN74AHC1G08; Operating Temperature Range(C): -55 to 125; PackageReference: DBV0005A; DatasheetVersion: SCLS314N; Input Type: CMOS; Sub-Family: AND Gate; 3-State Output: No
VR3-VR7 = 4.7k Variable Resistor: as VR9 on sheet ShutdownLoop; ComponentLink1Description: LCSC; ComponentLink1URL: https://lcsc.com/product-detail/Variable-Resistors_HDK-Hokuriku-Elec-Industry-VG039NCHXTB472_C128555.html

## Sheet BSPD_Simulation.SchDoc: QUTMS Shutdown V2.1 - BSPD Simulation
size A3; Author: Jonn Dillon; Organization: QUT Motorsport; Address1: O-120; Address2: O Block; Address3: QUT Gardens Point; Address4: Brisbane, 4000; DocumentNumber: 5; Revision: 11; SheetNumber: 5; SheetTotal: 7
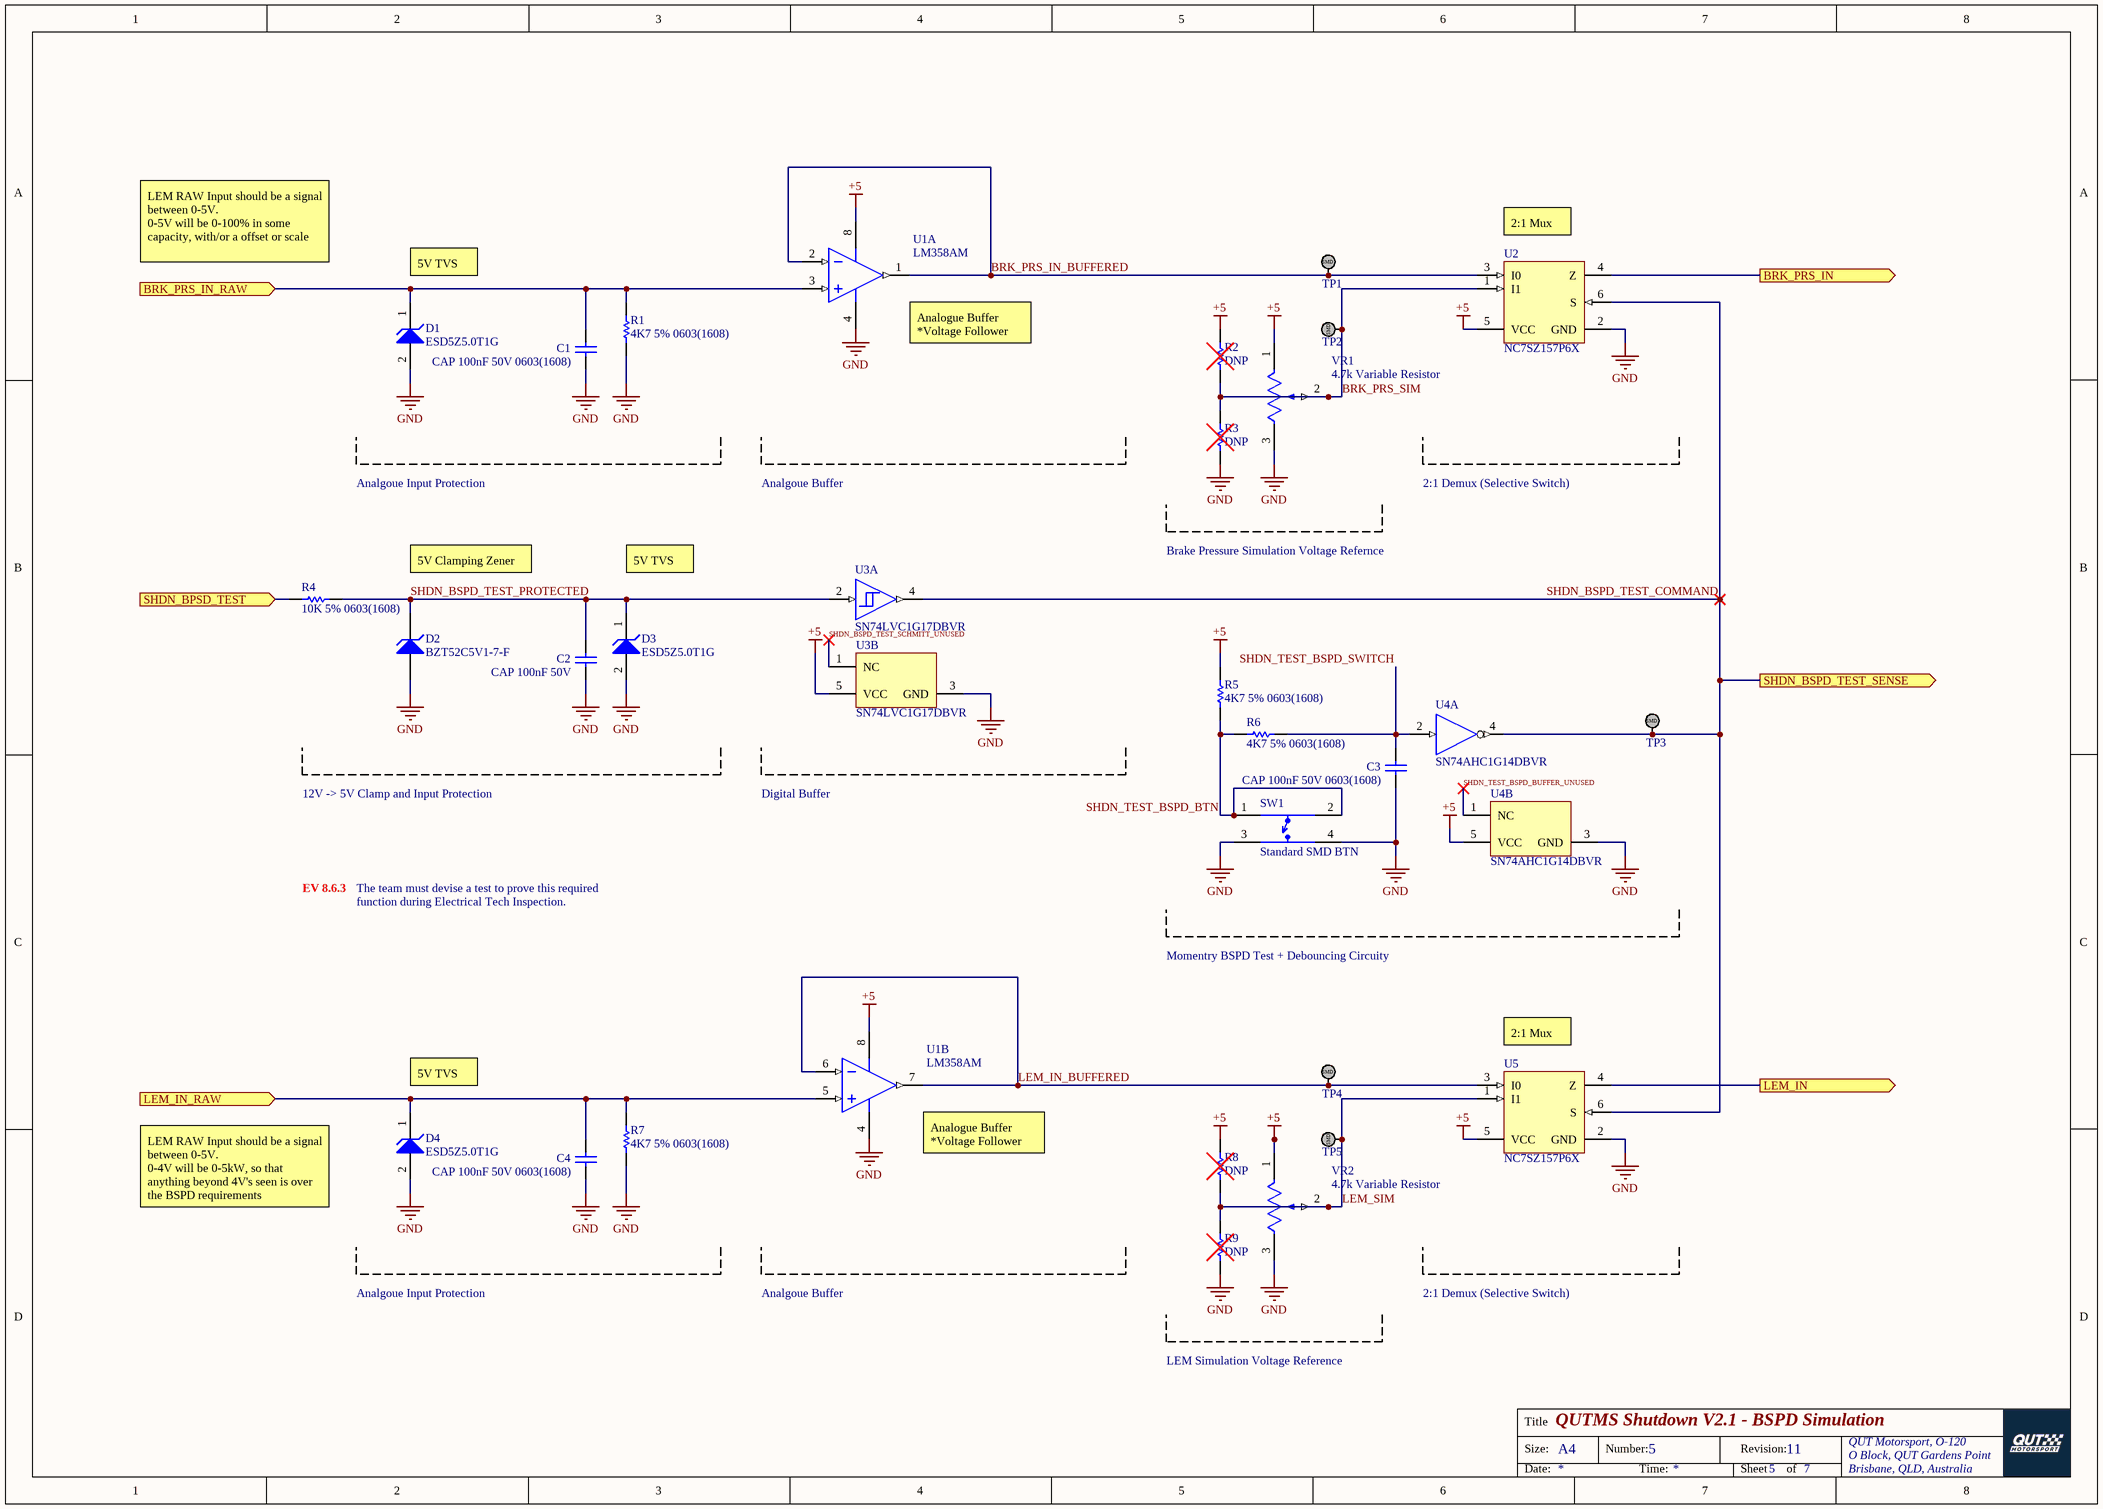
[diagram p6: BSPD_Simulation.SchDoc]

### Parts
C1  CAP 100nF 50V 0603(1608)  [CAPC0603(1608)100_L]
C2  CAP 100nF 50V  [CAPC0603(1608)100_L]
C3  CAP 100nF 50V 0603(1608)  [CAPC0603(1608)100_L]
C4  CAP 100nF 50V 0603(1608)  [CAPC0603(1608)100_L]
D1  ESD5Z5.0T1G  [ONSC-SOD-523-2-502-01_V]
D2  BZT52C5V1-7-F  [DIOD-SOD123_V]
D3  ESD5Z5.0T1G  [ONSC-SOD-523-2-502-01_V]
D4  ESD5Z5.0T1G  [ONSC-SOD-523-2-502-01_V]
R1  4K7 5% 0603(1608)  [RESC0603(1608)_N]
R2  DNP  [RESC0603(1608)_L]
R3  DNP  [RESC0603(1608)_L]
R4  10K 5% 0603(1608)  [RESC0603(1608)_N]
R5  4K7 5% 0603(1608)  [RESC0603(1608)_N]
R6  4K7 5% 0603(1608)  [RESC0603(1608)_N]
R7  4K7 5% 0603(1608)  [RESC0603(1608)_N]
R8  DNP  [RESC0603(1608)_L]
R9  DNP  [RESC0603(1608)_L]
SW1  Standard SMD BTN  [StandardSMDBTN]
TP1  TestPoint_SMD  [TestPointSMD]  (value not drawn)
TP2  TestPoint_SMD  [TestPointSMD]  (value not drawn)
TP3  TestPoint_SMD  [TestPointSMD]  (value not drawn)
TP4  TestPoint_SMD  [TestPointSMD]  (value not drawn)
TP5  TestPoint_SMD  [TestPointSMD]  (value not drawn)
U1  LM358AM  [D0008A_N]  (parts A,B of 2)
U2  NC7SZ157P6X  [FAIR-SC70-6_V]
U3  SN74LVC1G17DBVR  [DBV0005A_L]  (parts A,B of 2)
U4  SN74AHC1G14DBVR  [DBV0005A_L]  (parts A,B of 2)
U5  NC7SZ157P6X  [FAIR-SC70-6_V]
VR1  4.7k Variable Resistor  [VG039NCHXTB472]
VR2  4.7k Variable Resistor  [VG039NCHXTB472]

### Ports
BRK_PRS_IN (out), BRK_PRS_IN_RAW (in), LEM_IN (out), LEM_IN_RAW (in), SHDN_BPSD_TEST (in), SHDN_BSPD_TEST_SENSE (out)

### Nets
+5: R2.2 R5.2 R8.2 U1.8(V+) U2.5(VCC) U3.5(VCC) U4.5(VCC) U5.5(VCC) VR1.1 VR2.1
GND: C1.2 C2.2 C3.2 C4.2 D1.2(A) D2.1(A) D3.2(A) D4.2(A) R1.1 R3.1 R7.1 R9.1 SW1.3 SW1.4 U1.4(GND) U2.2(GND) U3.3(GND) U4.3(GND) U5.2(GND) VR1.3 VR2.3
BRK_PRS_IN: U2.4(Z) ; port BRK_PRS_IN
BRK_PRS_IN_BUFFERED: TP1.1 U1.1(OUTA) U1.2(INA-) U2.3(I0)
BRK_PRS_IN_RAW: C1.1 D1.1(K) R1.2 U1.3(INA+) ; port BRK_PRS_IN_RAW
BRK_PRS_SIM: R2.1 R3.2 TP2.1 U2.1(I1) VR1.2
LEM_IN: U5.4(Z) ; port LEM_IN
LEM_IN_BUFFERED: TP4.1 U1.6(INB-) U1.7(OUTB) U5.3(I0)
LEM_IN_RAW: C4.1 D4.1(K) R7.2 U1.5(INB+) ; port LEM_IN_RAW
LEM_SIM: R8.1 R9.2 TP5.1 U5.1(I1) VR2.2
SHDN_BPSD_TEST: R4.2 ; port SHDN_BPSD_TEST
SHDN_BSPD_TEST_COMMAND: TP3.1 U2.6(S) U3.4(Y) U4.4(Y) U5.6(S) ; port SHDN_BSPD_TEST_SENSE
SHDN_BSPD_TEST_PROTECTED: C2.1 D2.2(K) D3.1(K) R4.1 U3.2(A)
SHDN_BSPD_TEST_SCHMITT_UNUSED: U3.1(NC)
SHDN_TEST_BSPD_BTN: R5.1 R6.2 SW1.1 SW1.2
SHDN_TEST_BSPD_BUFFER_UNUSED: U4.1(NC)
SHDN_TEST_BSPD_SWITCH: C3.1 R6.1 U4.2(A)

### Notes on the sheet
- (near U2) 2:1 Mux
- LEM RAW Input should be a signal between 0-5V.
  0-5V will be 0-100% in some capacity, with/or a offset or scale
- 5V TVS
- (near U1) Analogue Buffer
  *Voltage Follower
- Analgoue Input Protection
- Analgoue Buffer
- 2:1 Demux (Selective Switch)
- 5V Clamping Zener
- Brake Pressure Simulation Voltage Refernce
- 12V -> 5V Clamp and Input Protection
- Digital Buffer
- EV 8.6.3
- The team must devise a test to prove this required
- function during Electrical Tech Inspection.
- Momentry BSPD Test + Debouncing Circuity
- (near U5) 2:1 Mux
- LEM RAW Input should be a signal between 0-5V.
  0-4V will be 0-5kW, so that anything beyond 4V's seen is over the BSPD requirements
  5V =
- LEM Simulation Voltage Reference
- Title
- Size:
- A4
- Number:
- Revision:
- QUT Motorsport, O-120
- O Block, QUT Gardens Point
- Date:
- Time:
- Sheet
- of
- Brisbane, QLD, Australia
- (in symbol TestPoint_SMD) SMD

### Library data of the parts
C1-C4 = CMP-1035-02591-1: as C15 on sheet ShutdownLoop; Rated Voltage: 50 V; Max Thickness: 1 mm; Technology: SMT; Value: 100nF
D1 D3 D4 = CMP-1063-00102-1: as D6 on sheet Power; PackageVersion: Rev. E, 09/2010; Mounting Technology: Surface Mount; Packing: Tape and Reel; ComponentLink2URL: http://www.onsemi.cn/pub_link/Collateral/ESD5Z2.5T1-D.PDF; ComponentLink2Description: Datasheet; PackageReference: SOD-523-2-502-01; ComponentLink1Description: Manufacturer URL; ComponentLink3URL: http://www.onsemi.com/pub_link/Collateral/502-01.PDF; PackageDescription: 2-Pin SOD, Body 1.2 x 0.8 mm; ComponentLink3Description: Package Specification; ComponentLink1URL: http://www.onsemi.com/; RoHS: Pb-Free; PartNumber: ESD5Z5.0T1G; DatasheetVersion: Rev. 10
D2 = CMP-2000-05976-1: as D9 on sheet ShutdownLoop; Height: 1.35mm; Width: 1.7mm; Minimum Operating Temperature: -65C; Series: BZT52C5; Package Description: 2-Pin Surface Mount Device, Body 2.7 x 1.55 mm; Length: 2.85mm; Mounting Technology: SurfaceMount; Brand: DiodesIncorporated; Factory Pack Quantity: 3000; Product Category: ZenerDiodes; RoHS: True; Manufacturer URL: http://www.diodes.com/; Termination Style: SMD/SMT; Package / Case: SOD-123; Packaging: Reel; Package Reference: SOD123; Datasheet Version: Rev. 37-2, 09/2012; Maximum Operating Temperature: +150C; Datasheet URL: http://www.diodes.com/_files/datasheets/ds18004.pdf; Mounting Style: SMD/SMT
R1 R5-R7 = CMP-1012-00090-1: as R31 on sheet ShutdownLoop; Tolerance: 5 %; Technology: SMT; Power: 0.1 W
R2 R3 R8 R9 = CMP-1591-00001-1: as R10 on sheet BSPD_System; PackageReference: RESC0603(1608)
R4 = CMP-1012-00098-1: as R30 on sheet ShutdownLoop; Technology: SMT; Tolerance: 5 %; Power: 0.1 W
SW1 = Standard SMD BTN: Cost common SMD button, 4 Lead; ComponentLink1Description: LCSC; ComponentLink1URL: https://lcsc.com/product-detail/Tactile-Switches_BRIGHT-TSA063G50-250_C294565.html
U1 = CMP-0055-00796-3: as U6 on sheet BSPD_System; Code_JEDEC: MS-012-AA; RoHS: N; PinCount: 8; Package Reference: D0008A; ComponentLink1Description: Datasheet URL; ComponentLink1URL: http://www.ti.com/general/docs/lit/getliterature.tsp?genericPartNumber=LM358-N&fileType=pdf; Code_IPC: SOIC127P600-8; PackageDescription: SOIC Narrow, 4.9 x 3.9 x 1.45mm, 8 Lead, 1.27mm Pitch
U2 U5 = CMP-2000-06819-1: Tinylogic(R) UHS 2-Input Non-Inverting Multiplexer, 1.65 to 5.5 V, -40 to 85 degC, 6-Pin SOT23 (SC70), RoHS, Tape and Reel; Manufacturer: FairchildSemiconductor; Maximum Low Level Output Current: 32mA; Configuration: 1x2:1; Logic Family: TinyLogicUHS; Maximum Operating Supply Voltage: 5.5V; Number of Inputs per Chip: 2; Maximum Propagation Delay Time @ Maximum CL: 4.6@3.3V; Maximum High Level Output Current: -32mA; Rad Hard: No; Minimum Operating Supply Voltage: 1.65V; Tolerant I/Os: 5.5InputsV; Package: 6SC-70; Package Description: 6-Pin Small Outline Transistor, Body 2 x 1.25 mm, Pitch 0.65 mm; Datasheet Version: 09/2009; Mounting Technology: SurfaceMount; Package URL: https://www.fairchildsemi.com/package-drawings/MA/MAA06A.pdf; Package Reference: SC70-6; Category: Multiplexer; Manufacturer URL: https://www.fairchildsemi.com/; Logic Function: Multiplexer; Packaging: Tape&Reel; Datasheet URL: https://www.fairchildsemi.com/datasheets/NC/NC7SZ157.pdf
U3 = CMP-0859-00033-4: Single Schmitt-Trigger Buffer, DBV0005A, LARGE T&R; Manufacturer: Texas Instruments; Output Drive (IOL/IOH)(Max)(mA): 32/-32; Technology Family: LVC; ICC @ Nom Voltage(Max)(mA): 0.01; VCC(Min)(V): 1.65; F @ Nom Voltage(Max)(Mhz): 150; Schmitt Trigger: Yes; Voltage(Nom)(V): 1.8,2.5,3.3,5; 3-State Output: No; Bits(#): 1; VCC(Max)(V): 5.5; Input Type: CMOS/TTL; Logic: True; tpd @ Nom Voltage(Max)(ns): 11,6.5,5.5,5; Output Type: CMOS; Rating: Catalog; Sub-Family: Non-Inverting Buffer/Driver; PackageReference: DBV0005A; DatasheetVersion: SCES351V; Generic Part Number: SN74LVC1G17; Operating Temperature Range(C): -40 to 125,-40 to 85
U4 = CMP-2000-07131-1: Single Schmitt-Trigger Inverter Gate, 10.6 ns max, 2 to 5.5 V, -40 to 125 degC, 5-Pin SOT23 (DBV), Green (RoHS & no Sb/Br), Tape and Reel; Manufacturer: Texas Instruments; Supply Voltage Min: 2V; Logic IC Function: SingleInverterwithSchmittTrigger; No. of Pins: 5; Logic IC Family: AHC; Output Current: 8mA; Supply Voltage: 5.5V; Logic Function Number: 741G14; SVHC: NoSVHC(19-Dec-2012); No. of Gates: 1; Base Number: 74; Supply Voltage Range: 2Vto5.5V; Logic IC Base Number: 74114; Logic Case Style: SOT-23; Datasheet Version: Rev. Q, 09/2015; Mounting Technology: SurfaceMount; Termination Type: SMD; Operating Temperature Max: 85°C; IC Generic Number: 74AHC1G14; Operating Temperature Min: -40°C; No. of Inputs: 1; Supply Voltage Max: 5.5V; Datasheet URL: http://www.ti.com/lit/ds/symlink/sn74ahc1g14.pdf; Package Description: 5-Pin Small Outline Transistor, Body 2.9 x 1.6 mm, Pitch 0.95 mm; Operating Temperature Range: -40°Cto+85°C; Output Current Max: 8mA; Package URL: http://www.ti.com/lit/ml/mpds018l/mpds018l.pdf; Package Reference: DBV0005A; Logic Type: Inverter; Manufacturer URL: http://www.ti.com/; Package / Case: SOT-23
VR1 VR2 = 4.7k Variable Resistor: as VR9 on sheet ShutdownLoop; ComponentLink1Description: LCSC; ComponentLink1URL: https://lcsc.com/product-detail/Variable-Resistors_HDK-Hokuriku-Elec-Industry-VG039NCHXTB472_C128555.html